# EAGLE design Nodino-RC7 (EAGLE 6.1)
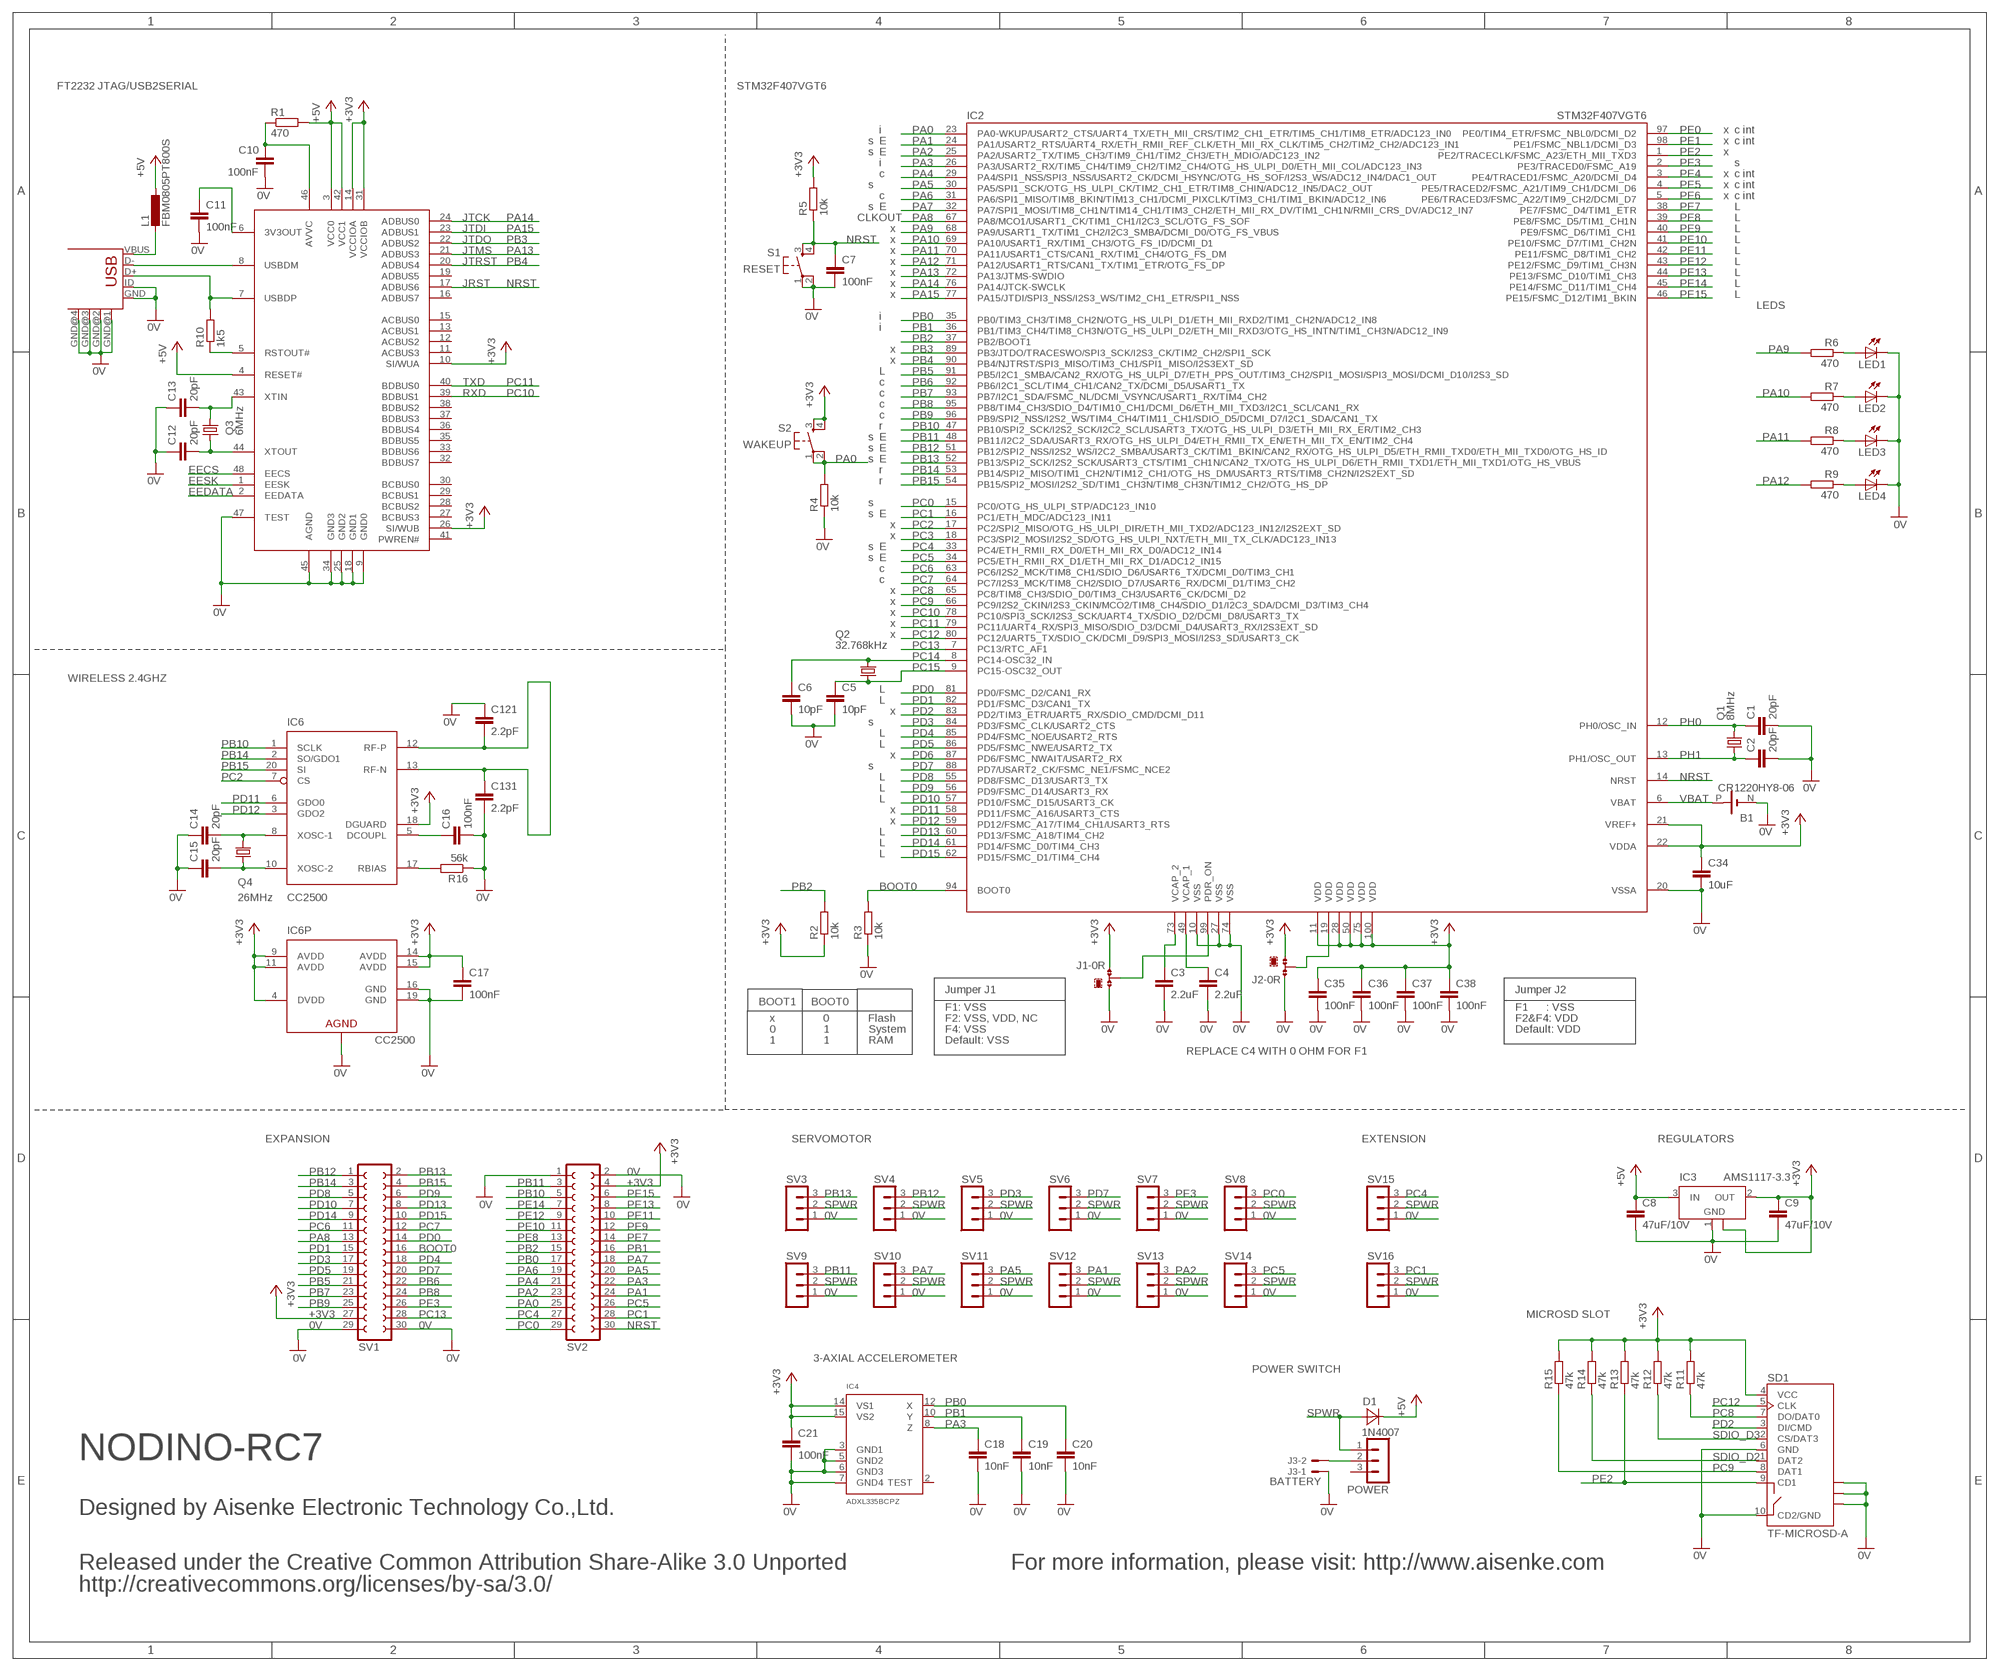
[diagram p0: schematic, sheet 1]

## Parts
B1  CR1220HY8-06  [HY8-06]
C1  20pF  C-EUC0603K  [C0603K]
C2  20pF  C-EUC0603K  [C0603K]
C3  2.2uF  C-EUC0603K  [C0603K]
C4  2.2uF  C-EUC0603K  [C0603K]
C5  10pF  C-EUC0603K  [C0603K]
C6  10pF  C-EUC0603K  [C0603K]
C7  100nF  C-EUC0603K  [C0603K]
C8  47uF/10V  C-EUC3225  [C3225]
C9  47uF/10V  C-EUC3225  [C3225]
C10  100nF  C-EUC0603K  [C0603K]
C11  100nF  C-EUC0603K  [C0603K]
C12  20pF  C-EUC0603K  [C0603K]
C13  20pF  C-EUC0603K  [C0603K]
C14  20pF  C-EUC0603K  [C0603K]
C15  20pF  C-EUC0603K  [C0603K]
C16  100nF  C-EUC0603K  [C0603K]
C17  100nF  C-EUC0603K  [C0603K]
C18  10nF  C-EUC0603K  [C0603K]
C19  10nF  C-EUC0603K  [C0603K]
C20  10nF  C-EUC0603K  [C0603K]
C21  100nF  C-EUC0603K  [C0603K]
C34  10uF  C-EUC0603K  [C0603K]
C35  100nF  C-EUC0603K  [C0603K]
C36  100nF  C-EUC0603K  [C0603K]
C37  100nF  C-EUC0603K  [C0603K]
C38  100nF  C-EUC0603K  [C0603K]
C121  2.2pF  C-EUC0603K  [C0603K]
C131  2.2pF  C-EUC0603K  [C0603K]
D1  1N4007  [DO214AC]
IC1  FT2232D  FT2232C  [LQFP48]
IC2  STM32F407VGT6  [LQFP100]
IC3  AMS1117-3.3  [SOT223]
IC4  ADXL335BCPZ  ADXL335WAVE  [LFCSP16-W]
IC6  CC2500  [QLP-20]
J1  0R-JUMPA0603  [A0R-JMP0603K]
J2  0R-JUMPA0603  [A0R-JMP0603K]
J3  BATTERY  22-27-2021-02  [6410-02]
L1  FBM0805PT800S  L-EUL0805  [L0805]
LED1  LEDCHIP-LED0805  [CHIP-LED0805]
LED2  LEDCHIP-LED0805  [CHIP-LED0805]
LED3  LEDCHIP-LED0805  [CHIP-LED0805]
LED4  LEDCHIP-LED0805  [CHIP-LED0805]
POWER  MA03-1  [MA03-1]
Q1  8MHz  CSM-7X-DU  [CSM-7X-DU]
Q2  32.768kHz  MC-306  [MC-306]
Q3  6MHz  CSM-7X-DU  [CSM-7X-DU]
Q4  26MHz  CSM-7X-DU  [CSM-7X-DU]
R1  470  R-EU_R0603K  [R0603K]
R2  10k  R-EU_R0603K  [R0603K]
R3  10k  R-EU_R0603K  [R0603K]
R4  10k  R-EU_R0603K  [R0603K]
R5  10k  R-EU_R0603K  [R0603K]
R6  470  R-EU_R0603K  [R0603K]
R7  470  R-EU_R0603K  [R0603K]
R8  470  R-EU_R0603K  [R0603K]
R9  470  R-EU_R0603K  [R0603K]
R10  1k5  R-EU_R0603K  [R0603K]
R11  47k  R-EU_R0603K  [R0603K]
R12  47k  R-EU_R0603K  [R0603K]
R13  47k  R-EU_R0603K  [R0603K]
R14  47k  R-EU_R0603K  [R0603K]
R15  47k  R-EU_R0603K  [R0603K]
R16  56k  R-EU_R0603K  [R0603K]
S1  RESET  ALCOSWITCH-SMD  [ALCOSWITCH-SMD]
S2  WAKEUP  ALCOSWITCH-SMD  [ALCOSWITCH-SMD]
SD1  TF-MICROSD-A  [MICROSD/CD]
SV1  FE15-2  [FE15-2]
SV2  FE15-2  [FE15-2]
SV3  MA03-1  [MA03-1]
SV4  MA03-1  [MA03-1]
SV5  MA03-1  [MA03-1]
SV6  MA03-1  [MA03-1]
SV7  MA03-1  [MA03-1]
SV8  MA03-1  [MA03-1]
SV9  MA03-1  [MA03-1]
SV10  MA03-1  [MA03-1]
SV11  MA03-1  [MA03-1]
SV12  MA03-1  [MA03-1]
SV13  MA03-1  [MA03-1]
SV14  MA03-1  [MA03-1]
SV15  MA03-1  [MA03-1]
SV16  MA03-1  [MA03-1]
USB1  USB-SHIELD  [USB-M-S1]

## Nets
0V: B1.N(-) C1.2 C2.2 C3.2 C4.2 C5.2 C6.2 C7.2 C8.2 C9.2 C10.2 C11.2 C12.1 C13.1 C14.1 C15.1 C16.2 C17.2 C18.2 C19.2 C20.2 C21.2 C34.2 C35.2 C36.2 C37.2 C38.2 C121.1 C131.2 IC1.9(GND0) IC1.18(GND1) IC1.25(GND2) IC1.34(GND3) IC1.45(AGND) IC1.47(TEST) IC2.10(VSS) IC2.20(VSSA) IC2.27(VSS) IC2.74(VSS) IC3.1(GND) IC4.3(GND1) IC4.5(GND2) IC4.6(GND3) IC4.7(GND4) IC6.16(GND) IC6.19(GND) IC6.21(AGND) J1.1 J2.3 J3.1 LED1.C LED2.C LED3.C LED4.C R3.1 R4.1 R16.1 S1.1(P) S1.2(P1) SD1.6(GND) SD1.10(CD2/GND) SD1.11(GND) SD1.12(GND) SD1.13(GND) SV1.29 SV1.30 SV2.1 SV2.2 SV3.1 SV4.1 SV5.1 SV6.1 SV7.1 SV8.1 SV9.1 SV10.1 SV11.1 SV12.1 SV13.1 SV14.1 SV15.1 SV16.1 USB1.GND USB1.GND@1(GND) USB1.GND@2(GND) USB1.GND@3(GND) USB1.GND@4(GND) USB1.ID
+3V3: C9.1 C17.1 C21.1 C34.1 C35.1 C36.1 C37.1 C38.1 IC1.10(SI/WUA) IC1.14(VCCIOA) IC1.26(SI/WUB) IC1.31(VCCIOB) IC2.11(VDD) IC2.21(VREF+) IC2.22(VDDA) IC2.28(VDD) IC2.50(VDD) IC2.75(VDD) IC2.100(VDD) IC3.2(OUT) IC3.4(GND) IC4.14(VS1) IC4.15(VS2) IC6.4(DVDD) IC6.9(AVDD) IC6.11(AVDD) IC6.14(AVDD) IC6.15(AVDD) IC6.18(DGUARD) J1.3 J2.1 R2.1 R5.2 R11.2 R12.2 R13.2 R14.2 R15.2 S2.3(S) S2.4(S1) SD1.4(VCC) SV1.27 SV2.4
+5V: C8.1 D1.C IC1.3(VCC0) IC1.4(RESET#) IC1.42(VCC1) IC3.3(IN) L1.1 R1.2
BOOT0: IC2.94(BOOT0) R3.2 SV1.16
DCOUPL: C16.1 IC6.5(DCOUPL)
EECS: IC1.48(EECS)
EEDATA: IC1.2(EEDATA)
EESK: IC1.1(EESK)
FOLDED_DIPOLE_ANTENNA: C121.2 C131.1 IC6.12(RF-P) IC6.13(RF-N)
N$1: C15.2 IC6.10(XOSC-2) Q4.1
N$2: C3.1 IC2.73(VCAP_2)
N$3: C14.2 IC6.8(XOSC-1) Q4.2
N$4: C4.1 IC2.49(VCAP_1)
N$5: IC1.8(USBDM) USB1.D-
N$6: IC2.99(PDR_ON) J1.2
N$7: LED1.A R6.1
N$8: LED2.A R7.1
N$9: LED3.A R8.1
N$10: LED4.A R9.1
N$11: IC1.7(USBDP) R10.2 USB1.D+
N$12: L1.2 USB1.VBUS
N$13: IC1.5(RSTOUT#) R10.1
N$14: C10.1 IC1.46(AVVC) R1.1
N$15: C11.1 IC1.6(3V3OUT)
N$16: C12.2 IC1.44(XTOUT) Q3.1
N$17: C13.2 IC1.43(XTIN) Q3.2
N$18: IC6.17(RBIAS) R16.2
N$19: IC2.19(VDD) J2.2
N$20: J3.2 POWER.2
NRST: C7.1 IC1.17(ADBUS6) IC2.14(NRST) R5.1 S1.3(S) S1.4(S1) SV2.30
PA0: IC2.23(PA0-WKUP/USART2_CTS/UART4_TX/ETH_MII_CRS/TIM2_CH1_ETR/TIM5_CH1/TIM8_ETR/ADC123_IN0) R4.2 S2.1(P) S2.2(P1) SV2.25
PA1: IC2.24(PA1/USART2_RTS/UART4_RX/ETH_RMII_REF_CLK/ETH_MII_RX_CLK/TIM5_CH2/TIM2_CH2/ADC123_IN1) SV2.24 SV12.3
PA2: IC2.25(PA2/USART2_TX/TIM5_CH3/TIM9_CH1/TIM2_CH3/ETH_MDIO/ADC123_IN2) SV2.23 SV13.3
PA3: C18.1 IC2.26(PA3/USART2_RX/TIM5_CH4/TIM9_CH2/TIM2_CH4/OTG_HS_ULPI_D0/ETH_MII_COL/ADC123_IN3) IC4.8(Z) SV2.22
PA4: IC2.29(PA4/SPI1_NSS/SPI3_NSS/USART2_CK/DCMI_HSYNC/OTG_HS_SOF/I2S3_WS/ADC12_IN4/DAC1_OUT) SV2.21
PA5: IC2.30(PA5/SPI1_SCK/OTG_HS_ULPI_CK/TIM2_CH1_ETR/TIM8_CHIN/ADC12_IN5/DAC2_OUT) SV2.20 SV11.3
PA6: IC2.31(PA6/SPI1_MISO/TIM8_BKIN/TIM13_CH1/DCMI_PIXCLK/TIM3_CH1/TIM1_BKIN/ADC12_IN6) SV2.19
PA7: IC2.32(PA7/SPI1_MOSI/TIM8_CH1N/TIM14_CH1/TIM3_CH2/ETH_MII_RX_DV/TIM1_CH1N/RMII_CRS_DV/ADC12_IN7) SV2.18 SV10.3
PA8: IC2.67(PA8/MCO1/USART1_CK/TIM1_CH1/I2C3_SCL/OTG_FS_SOF) SV1.13
PA9: IC2.68(PA9/USART1_TX/TIM1_CH2/I2C3_SMBA/DCMI_D0/OTG_FS_VBUS) R6.2
PA10: IC2.69(PA10/USART1_RX/TIM1_CH3/OTG_FS_ID/DCMI_D1) R7.2
PA11: IC2.70(PA11/USART1_CTS/CAN1_RX/TIM1_CH4/OTG_FS_DM) R8.2
PA12: IC2.71(PA12/USART1_RTS/CAN1_TX/TIM1_ETR/OTG_FS_DP) R9.2
PA13: IC1.21(ADBUS3) IC2.72(PA13/JTMS-SWDIO)
PA14: IC1.24(ADBUS0) IC2.76(PA14/JTCK-SWCLK)
PA15: IC1.23(ADBUS1) IC2.77(PA15/JTDI/SPI3_NSS/I2S3_WS/TIM2_CH1_ETR/SPI1_NSS)
PB0: C20.1 IC2.35(PB0/TIM3_CH3/TIM8_CH2N/OTG_HS_ULPI_D1/ETH_MII_RXD2/TIM1_CH2N/ADC12_IN8) IC4.12(X) SV2.17
PB1: C19.1 IC2.36(PB1/TIM3_CH4/TIM8_CH3N/OTG_HS_ULPI_D2/ETH_MII_RXD3/OTG_HS_INTN/TIM1_CH3N/ADC12_IN9) IC4.10(Y) SV2.16
PB2: IC2.37(PB2/BOOT1) R2.2 SV2.15
PB3: IC1.22(ADBUS2) IC2.89(PB3/JTDO/TRACESWO/SPI3_SCK/I2S3_CK/TIM2_CH2/SPI1_SCK)
PB4: IC1.20(ADBUS4) IC2.90(PB4/NJTRST/SPI3_MISO/TIM3_CH1/SPI1_MISO/I2S3EXT_SD)
PB5: IC2.91(PB5/I2C1_SMBA/CAN2_RX/OTG_HS_ULPI_D7/ETH_PPS_OUT/TIM3_CH2/SPI1_MOSI/SPI3_MOSI/DCMI_D10/I2S3_SD) SV1.21
PB6: IC2.92(PB6/I2C1_SCL/TIM4_CH1/CAN2_TX/DCMI_D5/USART1_TX) SV1.22
PB7: IC2.93(PB7/I2C1_SDA/FSMC_NL/DCMI_VSYNC/USART1_RX/TIM4_CH2) SV1.23
PB8: IC2.95(PB8/TIM4_CH3/SDIO_D4/TIM10_CH1/DCMI_D6/ETH_MII_TXD3/I2C1_SCL/CAN1_RX) SV1.24
PB9: IC2.96(PB9/SPI2_NSS/I2S2_WS/TIM4_CH4/TIM11_CH1/SDIO_D5/DCMI_D7/I2C1_SDA/CAN1_TX) SV1.25
PB10: IC2.47(PB10/SPI2_SCK/I2S2_SCK/I2C2_SCL/USART3_TX/OTG_HS_ULPI_D3/ETH_MII_RX_ER/TIM2_CH3) IC6.1(SCLK) SV2.5
PB11: IC2.48(PB11/I2C2_SDA/USART3_RX/OTG_HS_ULPI_D4/ETH_RMII_TX_EN/ETH_MII_TX_EN/TIM2_CH4) SV2.3 SV9.3
PB12: IC2.51(PB12/SPI2_NSS/I2S2_WS/I2C2_SMBA/USART3_CK/TIM1_BKIN/CAN2_RX/OTG_HS_ULPI_D5/ETH_RMII_TXD0/ETH_MII_TXD0/OTG_HS_ID) SV1.1 SV4.3
PB13: IC2.52(PB13/SPI2_SCK/I2S2_SCK/USART3_CTS/TIM1_CH1N/CAN2_TX/OTG_HS_ULPI_D6/ETH_RMII_TXD1/ETH_MII_TXD1/OTG_HS_VBUS) SV1.2 SV3.3
PB14: IC2.53(PB14/SPI2_MISO/TIM1_CH2N/TIM12_CH1/OTG_HS_DM/USART3_RTS/TIM8_CH2N/I2S2EXT_SD) IC6.2(SO/GDO1) SV1.3
PB15: IC2.54(PB15/SPI2_MOSI/I2S2_SD/TIM1_CH3N/TIM8_CH3N/TIM12_CH2/OTG_HS_DP) IC6.20(SI) SV1.4
PC0: IC2.15(PC0/OTG_HS_ULPI_STP/ADC123_IN10) SV2.29 SV8.3
PC1: IC2.16(PC1/ETH_MDC/ADC123_IN11) SV2.28 SV16.3
PC2: IC2.17(PC2/SPI2_MISO/OTG_HS_ULPI_DIR/ETH_MII_TXD2/ADC123_IN12/I2S2EXT_SD) IC6.7(CS)
PC3: IC2.18(PC3/SPI2_MOSI/I2S2_SD/OTG_HS_ULPI_NXT/ETH_MII_TX_CLK/ADC123_IN13)
PC4: IC2.33(PC4/ETH_RMII_RX_D0/ETH_MII_RX_D0/ADC12_IN14) SV2.27 SV15.3
PC5: IC2.34(PC5/ETH_RMII_RX_D1/ETH_MII_RX_D1/ADC12_IN15) SV2.26 SV14.3
PC6: IC2.63(PC6/I2S2_MCK/TIM8_CH1/SDIO_D6/USART6_TX/DCMI_D0/TIM3_CH1) SV1.11
PC7: IC2.64(PC7/I2S3_MCK/TIM8_CH2/SDIO_D7/USART6_RX/DCMI_D1/TIM3_CH2) SV1.12
PC8: IC2.65(PC8/TIM8_CH3/SDIO_D0/TIM3_CH3/USART6_CK/DCMI_D2) R11.1 SD1.7(DO/DAT0)
PC9: IC2.66(PC9/I2S2_CKIN/I2S3_CKIN/MCO2/TIM8_CH4/SDIO_D1/I2C3_SDA/DCMI_D3/TIM3_CH4) R15.1 SD1.8(DAT1)
PC10: IC1.39(BDBUS1) IC2.78(PC10/SPI3_SCK/I2S3_SCK/UART4_TX/SDIO_D2/DCMI_D8/USART3_TX)
PC11: IC1.40(BDBUS0) IC2.79(PC11/UART4_RX/SPI3_MISO/SDIO_D3/DCMI_D4/USART3_RX/I2S3EXT_SD)
PC12: IC2.80(PC12/UART5_TX/SDIO_CK/DCMI_D9/SPI3_MOSI/I2S3_SD/USART3_CK) SD1.5(CLK)
PC13: IC2.7(PC13/RTC_AF1) SV1.28
PC14: C6.1 IC2.8(PC14-OSC32_IN) Q2.4
PC15: C5.1 IC2.9(PC15-OSC32_OUT) Q2.1
PD0: IC2.81(PD0/FSMC_D2/CAN1_RX) SV1.14
PD1: IC2.82(PD1/FSMC_D3/CAN1_TX) SV1.15
PD2: IC2.83(PD2/TIM3_ETR/UART5_RX/SDIO_CMD/DCMI_D11) SD1.3(DI/CMD)
PD3: IC2.84(PD3/FSMC_CLK/USART2_CTS) SV1.17 SV5.3
PD4: IC2.85(PD4/FSMC_NOE/USART2_RTS) SV1.18
PD5: IC2.86(PD5/FSMC_NWE/USART2_TX) SV1.19
PD6: IC2.87(PD6/FSMC_NWAIT/USART2_RX)
PD7: IC2.88(PD7/USART2_CK/FSMC_NE1/FSMC_NCE2) SV1.20 SV6.3
PD8: IC2.55(PD8/FSMC_D13/USART3_TX) SV1.5
PD9: IC2.56(PD9/FSMC_D14/USART3_RX) SV1.6
PD10: IC2.57(PD10/FSMC_D15/USART3_CK) SV1.7
PD11: IC2.58(PD11/FSMC_A16/USART3_CTS) IC6.6(GDO0)
PD12: IC2.59(PD12/FSMC_A17/TIM4_CH1/USART3_RTS) IC6.3(GDO2)
PD13: IC2.60(PD13/FSMC_A18/TIM4_CH2) SV1.8
PD14: IC2.61(PD14/FSMC_D0/TIM4_CH3) SV1.9
PD15: IC2.62(PD15/FSMC_D1/TIM4_CH4) SV1.10
PE0: IC2.97(PE0/TIM4_ETR/FSMC_NBL0/DCMI_D2)
PE1: IC2.98(PE1/FSMC_NBL1/DCMI_D3)
PE2: IC2.1(PE2/TRACECLK/FSMC_A23/ETH_MII_TXD3) R13.1 SD1.9(CD1)
PE3: IC2.2(PE3/TRACED0/FSMC_A19) SV1.26 SV7.3
PE4: IC2.3(PE4/TRACED1/FSMC_A20/DCMI_D4)
PE5: IC2.4(PE5/TRACED2/FSMC_A21/TIM9_CH1/DCMI_D6)
PE6: IC2.5(PE6/TRACED3/FSMC_A22/TIM9_CH2/DCMI_D7)
PE7: IC2.38(PE7/FSMC_D4/TIM1_ETR) SV2.14
PE8: IC2.39(PE8/FSMC_D5/TIM1_CH1N) SV2.13
PE9: IC2.40(PE9/FSMC_D6/TIM1_CH1) SV2.12
PE10: IC2.41(PE10/FSMC_D7/TIM1_CH2N) SV2.11
PE11: IC2.42(PE11/FSMC_D8/TIM1_CH2) SV2.10
PE12: IC2.43(PE12/FSMC_D9/TIM1_CH3N) SV2.9
PE13: IC2.44(PE13/FSMC_D10/TIM1_CH3) SV2.8
PE14: IC2.45(PE14/FSMC_D11/TIM1_CH4) SV2.7
PE15: IC2.46(PE15/FSMC_D12/TIM1_BKIN) SV2.6
PH0: C1.1 IC2.12(PH0/OSC_IN) Q1.2
PH1: C2.1 IC2.13(PH1/OSC_OUT) Q1.1
SDIO_D2: R14.1 SD1.1(DAT2)
SDIO_D3: R12.1 SD1.2(CS/DAT3)
SPWR: D1.A POWER.1 SV3.2 SV4.2 SV5.2 SV6.2 SV7.2 SV8.2 SV9.2 SV10.2 SV11.2 SV12.2 SV13.2 SV14.2 SV15.2 SV16.2
VBAT: B1.P(+) IC2.6(VBAT)
Unconnected: IC1.11(ACBUS3) IC1.12(ACBUS2) IC1.13(ACBUS1) IC1.15(ACBUS0) IC1.16(ADBUS7) IC1.19(ADBUS5) IC1.27(BCBUS3) IC1.28(BCBUS2) IC1.29(BCBUS1) IC1.30(BCBUS0) IC1.32(BDBUS7) IC1.33(BDBUS6) IC1.35(BDBUS5) IC1.36(BDBUS4) IC1.37(BDBUS3) IC1.38(BDBUS2) IC1.41(PWREN#) IC4.2(TEST) POWER.3

## Notes on the sheet
- FT2232 JTAG/USB2SERIAL | STM32F407VGT6
- i | x | c int
- s | E | x | c int
- s | E | x
- i | s
- c | x | c int
- s | x | c int
- c | x | c int
- s | E | L
- JTCK | CLKOUT | L
- JTDI | x | L
- JTDO | x | L
- JTMS | x | L
- JTRST | x | L
- x | L
- JRST | x | L
- x | L
- LEDS
- i
- i
- x
- x
- L
- TXD | c
- RXD | c
- c
- c
- r
- s | E
- s | E
- s | E
- r
- r
- s
- s | E
- x
- x
- s | E
- s | E
- c
- c
- x
- x
- x
- x
- x
- WIRELESS 2.4GHZ
- L
- L
- x
- s
- L
- L
- x
- s
- L
- L
- L
- x
- x
- L
- L
- L
- Jumper J1 | Jumper J2
- BOOT1     BOOT0
- F1: VSS | F1      : VSS
- x                0             Flash | F2: VSS, VDD, NC | F2&F4: VDD
- 0                1             System | F4: VSS | Default: VDD
- 1                1             RAM | Default: VSS
- REPLACE C4 WITH 0 OHM FOR F1
- EXPANSION | SERVOMOTOR | EXTENSION | REGULATORS
- MICROSD SLOT
- 3-AXIAL ACCELEROMETER
- POWER SWITCH
- NODINO-RC7
- Designed by Aisenke Electronic Technology Co.,Ltd.
- Released under the Creative Common Attribution Share-Alike 3.0 Unported | For more information, please visit: http://www.aisenke.com
- http://creativecommons.org/licenses/by-sa/3.0/

## Library data of the parts
B1 = con-batteryholder:CR1220
C1-C21 C34-C38 C121 C131 = resistor:C-EU: CAPACITOR, European symbol
D1 = diode:1N4007
IC1 = ftdichip-3:FT2232C: USB UART / FIFO Controller 3nd Generation USB Double-UART (USB <-> Serial) - FIFO Controller
IC2 = stm32fxxx:STM32F407V: STM32F4xx High Performance Line with DSP in 100 pin packages
IC3 = advanced-micro-system:AMS1117: 1A Low Drop Output Voltage Regulator
IC4 = microbuilder:ADXL335: ADXL335 Low-Power 3 Axis Accelerometer LFCSP16-R - 16 Pin LFCSP Package (Reflow footprint) LFSCP16-W - 16 Pin LFCSP Package (Wave footprint with extended pads for hand soldering) Digikey: ADXL335BCPZ-RL7CT-ND
IC6 = chipcon-ti:CC2500: Single Chip Low Cost Low Power RF Transceiver frequency band at 2400MHz-2483.5MHz.
J1 J2 = jump-0r-smd:0R-JUMP: SMD 0R 0805 Jumper
J3 = con-molex:22-?-02: CONNECTOR wire to board 2.54 mm (.1 inch) pitch header; OC_FARNELL: unknown; OC_NEWARK: unknown
L1 = resistor:L-EU: INDUCTOR, European symbol
LED1-LED4 = led:LED: LED OSRAM: - CHIPLED LG R971, LG N971, LY N971, LG Q971, LY Q971, LO R971, LY R971 LH N974, LH R974 LS Q976, LO Q976, LY Q976 LO Q996 - Hyper CHIPLED LW Q18S LB Q993, LB Q99A, LB R99A - SideLED LS A670, LO A670, LY A670, LG A670, LP A670 LB A673, LV A673, LT A673, LW A673 LH A674 LY A675 LS A676, LA A676, LO A676, LY A676, LW A676 LS A679, LY A679, LG A679 - Hyper Micro SIDELED® LS Y876, LA Y876, LO Y876, LY Y876 LT Y87S - SmartLED LW L88C, LW L88S LB L89C, LB L89S, LG L890 LS L89K, LO L89K, LY L89K LS L896, LA L896, LO L896, LY L896 - TOPLED LS T670, LO T670, LY T670, LG T670, LP T670 LSG T670, LSP T670, LSY T670, LOP T670, LYG T670 LG T671, LOG T671, LSG T671 LB T673, LV T673, LT T673, LW T673 LH T674 LS T676, LA T676, LO T676, LY T676, LB T676, LH T676, LSB T676, LW T676 LB T67C, LV T67C, LT T67C, LS T67K, LO T67K, LY T67K, LW E67C LS E67B, LA E67B, LO E67B, LY E67B, LB E67C, LV E67C, LT E67C LW T67C LS T679, LY T679, LG T679 LS T770, LO T770, LY T770, LG T770, LP T770 LB T773, LV T773, LT T773, LW T773 LH T774 LS E675, LA E675, LY E675, LS T675 LS T776, LA T776, LO T776, LY T776, LB T776 LHGB T686 LT T68C, LB T68C - Hyper Mini TOPLED® LB M676 - Mini TOPLED Santana® LG M470 LS M47K, LO M47K, LY M47K Source: http://www.osram.convergy.de LUXEON: - LUMILED® LXK2-PW12-R00, LXK2-PW12-S00, LXK2-PW14-U00, LXK2-PW14-V00 LXK2-PM12-R00, LXK2-PM12-S00, LXK2-PM14-U00 LXK2-PE12-Q00, LXK2-PE12-R00, LXK2-PE12-S00, LXK2-PE14-T00, LXK2-PE14-U00 LXK2-PB12-K00, LXK2-PB12-L00, LXK2-PB12-M00, LXK2-PB14-N00, LXK2-PB14-P00, LXK2-PB14-Q00 LXK2-PR12-L00, LXK2-PR12-M00, LXK2-PR14-Q00, LXK2-PR14-R00 LXK2-PD12-Q00, LXK2-PD12-R00, LXK2-PD12-S00 LXK2-PH12-R00, LXK2-PH12-S00 LXK2-PL12-P00, LXK2-PL12-Q00, LXK2-PL12-R00 Source: www.luxeon.com KINGBRIGHT: KA-3528ASYC Source: www.kingbright.com
POWER SV3-SV16 = con-lstb:MA03-1: PIN HEADER; OC_FARNELL: unknown; OC_NEWARK: unknown
Q1 Q3 Q4 = crystal:CSM-7X-DU: SMD CRYSTAL Source: www.ecsxtal.com .. Crystal 3.6864MHz CSM_7X_DU.PDF; OC_FARNELL: unknown; OC_NEWARK: unknown
Q2 = crystal:MC-306: kHz RANGE CRYSTAL UNIT SMD Source: MC-306_405_406_E07X.PDF Homepage <http://www.epsontoyocom.co.jp>; MPN: MC-306 60.0KHZ 100PPM ,12.5PF; OC_FARNELL: 1278040; OC_NEWARK: 31M5576
R1-R16 = resistor:R-EU_: RESISTOR, European symbol
S1 S2 = switch-alco:ALCOSWITCH-SMD
SD1 = con-tf-microsd:TF-MICROSD-A
SV1 SV2 = con-lsta:FE15-2: FEMALE HEADER; OC_FARNELL: unknown; OC_NEWARK: unknown
USB1 = con-usb-2:USB-SHIELD

## Board
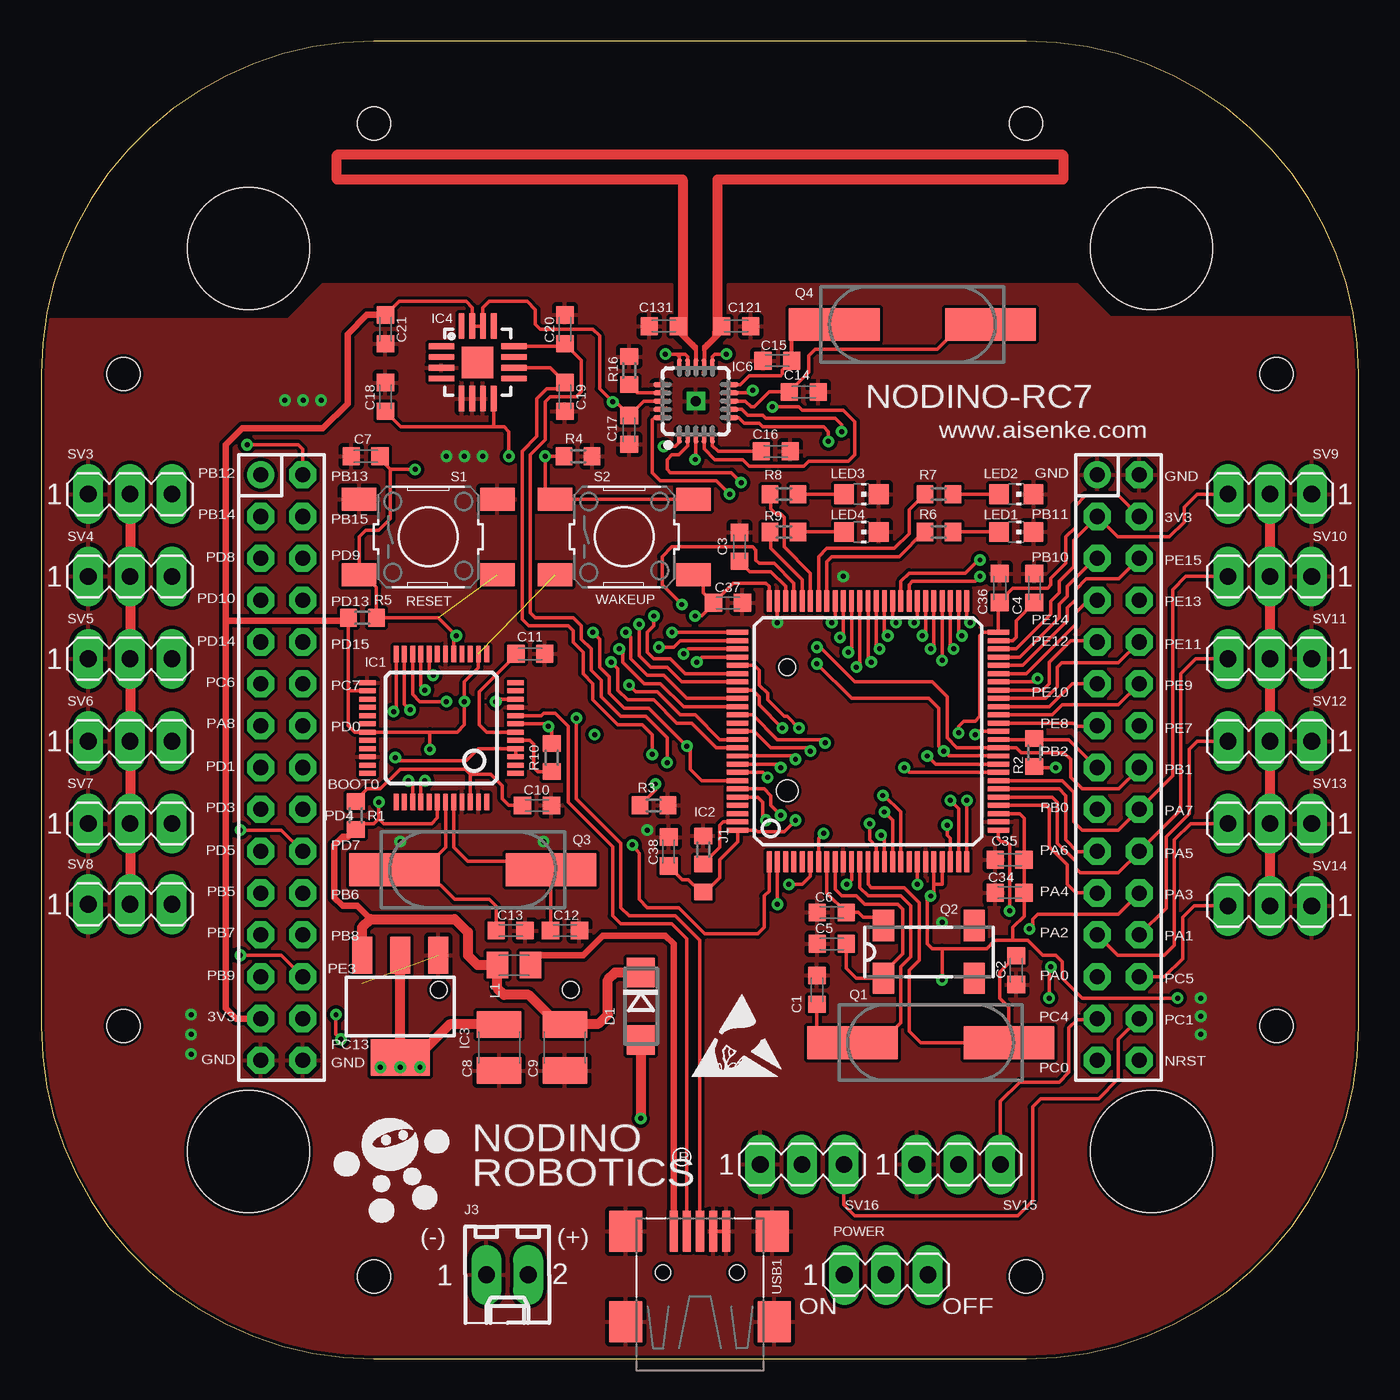
[diagram p1: board, top side]
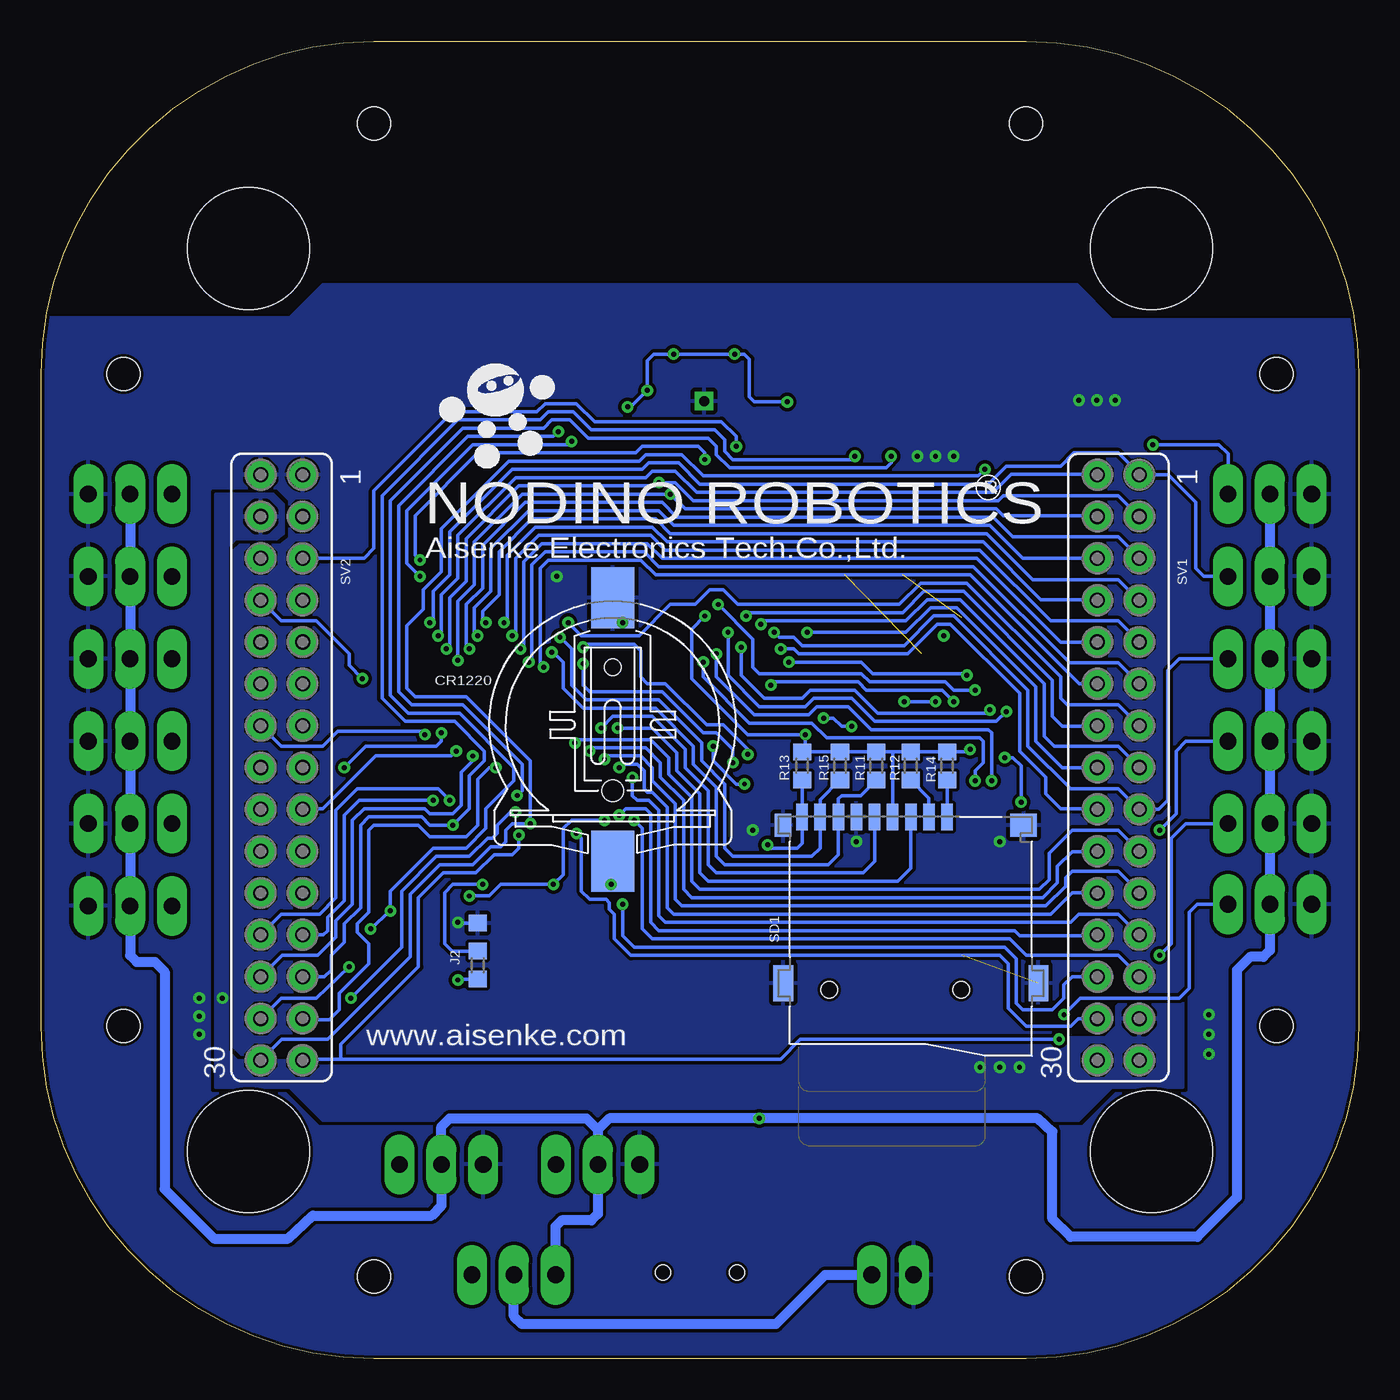
[diagram p2: board, bottom side, seen from below]

Size 80 x 80 mm. Coordinates in mm from the lower left corner, seen from the top.
Outline: 0,59.8 0,20.2 arc90 20.2,0 59.8,0 arc90 80,20.2 80,59.8 arc90 59.8,80 20.2,80 arc90 0,59.8
Copper layers (1*16): Top 0.035mm / dielectric 1.5mm / Bottom 0.035mm
Design rules: minimum track width 0.2mm, minimum drill 0.3mm, track to track 8mil, track to pad 8mil, pad to pad 7mil, via to via 8mil, smd to smd 7mil, copper to edge 8mil, drill to drill 8mil, minimum pad ring 10mil, minimum via ring 8mil, stop-mask expansion 2mil, vias tented up to drill 0mil, thermal gap 10mil
Holes 7.4 mm at 12.6,12.6 12.6,67.4 67.4,67.4 67.4,12.6
Holes 2 mm at 5,20.2 20.2,5 5,59.8 20.2,75 75,59.8 59.8,75 59.8,5 75,20.2

### Footprints (pad centres in the part's own frame; a part is rotated, then mirrored left to right if it is on the bottom)
HY8-06 = smd 3.7 x 2.6: N -7.7,0; P 8.3,0 | hole 1: -3.5,0 | hole 1.3: 4,0
C0603K = smd 1.05 x 1.08: 1 -0.875,0; 2 0.875,0
C3225 = smd 1.6 x 2.7: 1 -1.4,0; 2 1.4,0
DO214AC = smd 1.8 x 1.7: A 2.05,0; C -2.05,0
LQFP48 = smd 0.3 x 1: 1 -2.75,-4.5; 2 -2.25,-4.5; 3 -1.75,-4.5; 4 -1.25,-4.5; 5 -0.75,-4.5; 6 -0.25,-4.5; 7 0.25,-4.5; 8 0.75,-4.5; 9 1.25,-4.5; 10 1.75,-4.5; 11 2.25,-4.5; 12 2.75,-4.5; 25 2.75,4.5; 26 2.25,4.5; 27 1.75,4.5; 28 1.25,4.5; 29 0.75,4.5; 30 0.25,4.5; 31 -0.25,4.5; 32 -0.75,4.5; 33 -1.25,4.5; 34 -1.75,4.5; 35 -2.25,4.5; 36 -2.75,4.5 | smd 1 x 0.3: 13 4.5,-2.75; 14 4.5,-2.25; 15 4.5,-1.75; 16 4.5,-1.25; 17 4.5,-0.75; 18 4.5,-0.25; 19 4.5,0.25; 20 4.5,0.75; 21 4.5,1.25; 22 4.5,1.75; 23 4.5,2.25; 24 4.5,2.75; 37 -4.5,2.75; 38 -4.5,2.25; 39 -4.5,1.75; 40 -4.5,1.25; 41 -4.5,0.75; 42 -4.5,0.25; 43 -4.5,-0.25; 44 -4.5,-0.75; 45 -4.5,-1.25; 46 -4.5,-1.75; 47 -4.5,-2.25; 48 -4.5,-2.75
LQFP100 = smd 1.3 x 0.3: 1 -7.92,6; 2 -7.92,5.5; 3 -7.92,5; 4 -7.92,4.5; 5 -7.92,4; 6 -7.92,3.5; 7 -7.92,3; 8 -7.92,2.5; 9 -7.92,2; 10 -7.92,1.5; 11 -7.92,1; 12 -7.92,0.5; 13 -7.92,0; 14 -7.92,-0.5; 15 -7.92,-1; 16 -7.92,-1.5; 17 -7.92,-2; 18 -7.92,-2.5; 19 -7.92,-3; 20 -7.92,-3.5; 21 -7.92,-4; 22 -7.92,-4.5; 23 -7.92,-5; 24 -7.92,-5.5; 25 -7.92,-6; 51 7.92,-6; 52 7.92,-5.5; 53 7.92,-5; 54 7.92,-4.5; 55 7.92,-4; 56 7.92,-3.5; 57 7.92,-3; 58 7.92,-2.5; 59 7.92,-2; 60 7.92,-1.5; 61 7.92,-1; 62 7.92,-0.5; 63 7.92,0; 64 7.92,0.5; 65 7.92,1; 66 7.92,1.5; 67 7.92,2; 68 7.92,2.5; 69 7.92,3; 70 7.92,3.5; 71 7.92,4; 72 7.92,4.5; 73 7.92,5; 74 7.92,5.5; 75 7.92,6 | smd 0.3 x 1.3: 26 -6,-7.92; 27 -5.5,-7.92; 28 -5,-7.92; 29 -4.5,-7.92; 30 -4,-7.92; 31 -3.5,-7.92; 32 -3,-7.92; 33 -2.5,-7.92; 34 -2,-7.92; 35 -1.5,-7.92; 36 -1,-7.92; 37 -0.5,-7.92; 38 0,-7.92; 39 0.5,-7.92; 40 1,-7.92; 41 1.5,-7.92; 42 2,-7.92; 43 2.5,-7.92; 44 3,-7.92; 45 3.5,-7.92; 46 4,-7.92; 47 4.5,-7.92; 48 5,-7.92; 49 5.5,-7.92; 50 6,-7.92; 76 6,7.92; 77 5.5,7.92; 78 5,7.92; 79 4.5,7.92; 80 4,7.92; 81 3.5,7.92; 82 3,7.92; 83 2.5,7.92; 84 2,7.92; 85 1.5,7.92; 86 1,7.92; 87 0.5,7.92; 88 0,7.92; 89 -0.5,7.92; 90 -1,7.92; 91 -1.5,7.92; 92 -2,7.92; 93 -2.5,7.92; 94 -3,7.92; 95 -3.5,7.92; 96 -4,7.92; 97 -4.5,7.92; 98 -5,7.92; 99 -5.5,7.92; 100 -6,7.92
SOT223 = smd 1.219 x 2.235: 1 -2.311,-3.099; 2 0,-3.099; 3 2.311,-3.099 | smd 3.6 x 2.2: 4 0,3.099
LFCSP16-W = smd 1.9 x 1.9: 0 0,0 | smd 1.558 x 0.35: 1 -2.204,0.975; 2 -2.204,0.325; 3 -2.204,-0.325; 4 -2.204,-0.975; 9 2.204,-0.975; 10 2.204,-0.325; 11 2.204,0.325; 12 2.204,0.975 | smd 0.35 x 1.558: 5 -0.975,-2.204; 6 -0.325,-2.204; 7 0.325,-2.204; 8 0.975,-2.204; 13 0.975,2.204; 14 0.325,2.204; 15 -0.325,2.204; 16 -0.975,2.204
QLP-20 = smd 0.95 x 0.3: 1 -2.1,1; 2 -2.1,0.5; 3 -2.1,0; 4 -2.1,-0.5; 5 -2.1,-1; 11 2.1,-1; 12 2.1,-0.5; 13 2.1,0; 14 2.1,0.5; 15 2.1,1 | smd 0.3 x 0.95: 6 -1,-2.1; 7 -0.5,-2.1; 8 0,-2.1; 9 0.5,-2.1; 10 1,-2.1; 16 1,2.1; 17 0.5,2.1; 18 0,2.1; 19 -0.5,2.1; 20 -1,2.1 | drill 0.6 pad 1 square: 21 0,0
A0R-JMP0603K = smd 1.1 x 1: 1 0,0.85; 2 0,-0.85; 3 0,-2.552
6410-02 = drill 1.016 long: 1 1.27,0; 2 -1.27,0
L0805 = smd 1.3 x 1.6: 1 -1,0; 2 1,0
CHIP-LED0805 = smd 1.2 x 1.2: A 0,-1.05; C 0,1.05
MA03-1 = drill 1.016 long: 1 -2.54,0; 2 0,0; 3 2.54,0
CSM-7X-DU = smd 5.5 x 2: 1 -4.75,0; 2 4.75,0
MC-306 = smd 1.3 x 1.9: 1 -2.75,-1.6; 2 2.75,-1.6; 3 2.75,1.6; 4 -2.75,1.6
R0603K = smd 1 x 1.1: 1 -0.85,0; 2 0.85,0
ALCOSWITCH-SMD = smd 2.1 x 1.4: 1 -4.2,2.3; 2 4.2,2.3; 3 -4.2,-2.3; 4 4.2,-2.3
MICROSD/CD = smd 0.7 x 1.6: 1 2.2,3.5; 2 1.1,3.5; 3 0,3.5; 4 -1.1,3.5; 5 -2.2,3.5; 6 -3.3,3.5; 7 -4.4,3.5; 8 -5.5,3.5; 9 -6.6,3.5 | smd 1 x 1.4: 10 -7.75,3 | smd 1.2 x 2.2: 11 -7.75,-6.6; 12 7.75,-6.6 | smd 1.6 x 1.4: 13 6.85,3 | hole 1: 3.05,-7; -4.95,-7
FE15-2 = drill 0.914: 1 -17.78,1.27 | drill 0.914 octagon: 2 -17.78,-1.27; 3 -15.24,1.27; 4 -15.24,-1.27; 5 -12.7,1.27; 6 -12.7,-1.27; 7 -10.16,1.27; 8 -10.16,-1.27; 9 -7.62,1.27; 10 -7.62,-1.27; 11 -5.08,1.27; 12 -5.08,-1.27; 13 -2.54,1.27; 14 -2.54,-1.27; 15 0,1.27; 16 0,-1.27; 17 2.54,1.27; 18 2.54,-1.27; 19 5.08,1.27; 20 5.08,-1.27; 21 7.62,1.27; 22 7.62,-1.27; 23 10.16,1.27; 24 10.16,-1.27; 25 12.7,1.27; 26 12.7,-1.27; 27 15.24,1.27; 28 15.24,-1.27; 29 17.78,1.27; 30 17.78,-1.27
USB-M-S1 = smd 2.5 x 0.5: D+ 2.75,0; D- 2.75,0.8; GND 2.75,-1.6; ID 2.75,-0.8; VBUS 2.75,1.6 | smd 2.5 x 2: GND@1 -2.75,-4.5; GND@2 -2.75,4.5; GND@3 2.75,-4.4; GND@4 2.75,4.5 | hole 0.9: 0.25,2.25; 0.25,-2.25

### Placement (x,y rotation side)
B1  45.3,38.5 270 bottom
C1  47.1,22.4 90 top
C2  59.2,23.6 270 top
C3  42.4,49.3 90 top
C4  60.3,46.8 90 top
C5  48,25.2 180 top
C6  48,27.1 180 top
C7  19.7,54.8 180 top
C8  31.8,18.9 270 top
C9  27.8,18.9 270 top
C10  30.1,33.6 0 top
C11  29.7,42.8 0 top
C12  31.8,26 180 top
C13  28.5,26 180 top
C14  46.3,58.7 180 top
C15  44.7,60.6 0 top
C16  44.6,55.1 0 top
C17  35.7,56.4 270 top
C18  20.9,58.4 90 top
C19  31.8,58.4 270 top
C20  31.8,62.5 90 top
C21  20.9,62.5 270 top
C34  58.8,28.3 180 top
C35  58.8,30.3 180 top
C36  58.2,46.8 90 top
C37  41.7,45.9 0 top
C38  38.1,30.8 90 top
C121  42.2,62.7 180 top
C131  37.8,62.7 180 top
D1  36.4,21.4 270 top
IC1  24.3,38.3 90 top
IC2  50.2,38.1 90 top
IC3  21.8,21.4 180 top
IC4  26.5,60.5 0 top
IC6  39.75,58.15 90 top
J1  40.2,30.9 0 top
J2  53.5,23.9 180 bottom
J3  28.3,5.1 180 top
L1  28.7,23.9 0 top
LED1  59.2,50.2 270 top
LED2  59.2,52.5 270 top
LED3  49.8,52.5 270 top
LED4  49.8,50.2 270 top
POWER  51.3,5.1 0 top
Q1  54,19.2 180 top
Q2  53.9,24.7 0 top
Q3  26.2,29.7 180 top
Q4  52.9,62.8 0 top
R1  19.1,33 270 top
R2  60.3,36.8 90 top
R3  37.2,33.6 180 top
R4  32.6,54.8 180 top
R5  19.5,45 180 top
R6  54.5,50.2 180 top
R7  54.5,52.5 180 top
R8  45.1,52.5 180 top
R9  45.1,50.2 180 top
R10  31,36.5 90 top
R11  29.3,36 90 bottom
R12  27.2,36 90 bottom
R13  33.8,36 90 bottom
R14  25,36 90 bottom
R15  31.5,36 90 bottom
R16  35.7,60 270 top
S1  23.5,49.9 0 top
S2  35.4,49.9 0 top
SD1  27.2,29.4 0 bottom
SV1  14.6,35.9 270 bottom
SV2  65.4,35.9 270 bottom
SV3  5.4,52.5 0 top
SV4  5.4,47.5 0 top
SV5  5.4,42.5 0 top
SV6  5.4,37.5 0 top
SV7  5.4,32.5 0 top
SV8  5.4,27.6 0 top
SV9  74.6,52.5 180 top
SV10  74.6,47.5 180 top
SV11  74.6,42.5 180 top
SV12  74.6,37.5 180 top
SV13  74.6,32.5 180 top
SV14  74.6,27.5 180 top
SV15  55.7,11.8 0 top
SV16  46.2,11.8 0 top
USB1  40,5 90 top

### Tracks (layer width: path | path; a pad name or v marks a point on that pad's centre or on a via)
0V  (via drill 0.3)  (1 unrouted)
  Top 0.203: USB1.ID USB1.GND | IC2.74 v44.7,44.7
  Bottom 0.203: v54.7,26.5 54.65,26.45 J2.3 | B1.N 44.7,45.6 v44.7,44.7
  other vias: 30.5,31.4 36.8,32.1 48.7,47.5 21.8,31.4 17,58.2 14.8,58.2 15.9,58.2 24.6,54.8 25.7,54.8 26.8,54.8 9.1,20.9 9.1,19.7 9.1,18.5 70.4,21.9 70.4,20.8 70.4,19.7
  pour Top: 62.9,65.2 41.7,65.2 41.7,61.9 40.9,61.1 39.1,61.1 38.3,61.9 38.3,65.2 17.1,65.2 15,63.1 0.1,63.1 0.1,0.1 79.9,0.1 79.9,63.2 64.9,63.2
  pour Bottom (rank 2): 17.1,65.2 62.9,65.2 64.9,63.2 79.9,63.2 79.9,0.1 0.1,0.1 0.1,63.1 15,63.1
+3V3  (via drill 0.3)  (1 unrouted)
  Top 0.203: IC1.14 26.55,41.95 25.7,41.1 v25.7,39.9 25.7,38.5 25.25,38.05 23.6,38.05 | IC1.10 27.75,40.05 v27.6,39.9 | IC2.11 49.2,29.1 v48.9,28.8 | IC2.21 54.2,28.8 | 54.2,28.8 54.2,28.3 v54,28.1 53.8,27.9 53.8,25.2 54.1,24.9 54.7,24.9 | IC2.22 54.7,28.8 54.2,28.8 | IC2.28 59.4,33.1 59.67,32.83 C35.1 C34.1 59.67,26.88 59,26.2 59,25.4 | 58.12,45.91 IC2.50 57.2,44.1 57,43.9 57,39 56.7,38.7 56,38.7 55.7,38.4 v55.7,38 | 58.12,45.91 C36.1 | v61.6,35.9 60.35,35.9 R2.1 | v20.6,17.7 v21.8,17.7 | v21.8,17.7 v23,17.7 | v21.8,17.7 IC3.4 | 23.6,38.05 IC1.31 19.05,38.05 18.65,38.45 18.65,40.5 | IC1.26 18.7,40.55 18.65,40.5 | v23.6,37 23.6,38.05 | 54.7,24.9 57.4,24.9 57.9,25.4 59,25.4 | 54.7,24.9 v54.7,23 | C38.1 38.92,29.1 39.3,29.1 40.05,28.35 J1.3 40.35,28.35 41.2,29.2 41.2,30.3 42.28,31.38 IC2.100 43.4,32.1 43.5,32 45.1,32 v45.8,32.7 | 58.12,45.91 58.12,45.92 59,46.8 61.1,46.8 61.3,47 61.3,47.4 62.2,48.3 62.2,49.9 62.8,50.5 62.8,51.8 63.4,52.4 65.41,52.4 SV2.4 | R5.2 18.65,40.5 | IC2.75 44.2,46.9 44,47.1 42.02,47.1 C37.1 | C37.1 40.2,46.52 40.2,47 S2.4 | C37.1 40.83,45.83 40.1,45.1 v39.7,45.1 | 59,25.4 59.9,25.4 60.8,24.5 61.6,24.5 62,24.1 62,23.1 63.2,21.9 v69,21.9 | IC6.15 38.75,60.85 38.6,61 | 38.6,61 v37.9,61 | IC6.11 40.75,60.85 40.9,61 v41.6,61 | IC6.14 39.25,60.85 39.1,61 38.6,61 | IC6.18 36.58,58.15 C17.1 35.7,57.3 34.9,58.1 v34.7,58.1 33.9,58.9 33.9,62.1 33.5,62.5 30.3,62.5 30,62.8 30,63.7 29.5,64.2 27.2,64.2 26.82,63.83 IC4.14 IC4.15 26.18,63.83 25.8,64.2 21.73,64.2 C21.1 | IC6.9 43.05,58.65 v43.2,58.8 | v44.4,57.8 46,57.8 46.2,57.6 48.7,57.6 49.4,56.9 49.4,54.9 49,54.5 46.6,54.5 46.3,54.2 43,54.2 42.6,54.6 40.9,54.6 40.25,55.25 IC6.4
  Top 0.406: 11.2,44.8 18.45,44.8 R5.2 | 11.2,44.8 11.2,21.3 11.84,20.66 SV1.27 | 11.2,44.8 11.2,55.5 12.2,56.5 17.1,56.5 18.6,58 18.6,62.2 19.77,63.38 C21.1
  Top 0.61: IC3.2 IC3.4 22.8,18.3 24.8,20.3 C9.1
  Bottom 0.203: v25.7,39.9 v27.6,39.9 | 28.3,36.85 R12.2 R14.2 23.75,36.85 v23.6,37 | 28.3,36.85 R11.2 R15.2 R13.2 33.6,37.05 v33.6,37.9 37.1,37.9 40.5,41.3 40.5,44.3 v39.7,45.1 | SD1.4 28.3,36.85 | v54,28.1 52.8,28.1 52.1,28.8 v48.9,28.8 48.3,29.4 48.3,32.2 47.8,32.7 v45.8,32.7 | v54.7,23 54.65,23.05 J2.1 | v61.6,35.9 60.3,37.2 56,37.2 55.7,37.5 v55.7,38 | v34.7,58.1 36.7,58.1 37,58.4 37,60.7 37.3,61 v37.9,61 v41.6,61 42.8,61 43.2,60.6 v43.2,58.8 44.2,57.8 v44.4,57.8
  pour Bottom: 10.7,16.5 10.7,22 14.1,22 14.7,21.4 14.7,20.2 15.4,19.5 17.9,19.5 18.1,19.3 33.9,19.3 35.1,18.1 68.1,18.1 68.7,18.7 68.7,49.3 68.2,49.8 65.7,49.8 65.3,50.1 65.3,51.9 65.9,52.5 69.4,52.5 69.4,16.5 64.9,16.5 62.9,14.5 17,14.5 15,16.5
+5V  (via drill 0.3)
  Top 0.203: IC1.3 IC1.4 26.55,37.05 25.8,36.3 21.7,36.3 v21.5,36.5 | IC1.42 24.05,32.85 23.7,32.5 20.8,32.5 20.5,32.8 | 19.45,32.5 20.2,32.5 20.5,32.8 | v20.5,33.8 20.5,32.8
  Top 0.254: 19.45,32.5 R1.2
  Top 0.406: 20,26.7 19.2,27.5 18.3,27.5 17.8,28 17.8,31.2 18.3,31.7 18.65,31.7 R1.2
  Top 0.61: IC3.3 19.49,26.19 20,26.7 25.1,26.7 25.9,25.9 25.9,24.5 26.5,23.9 L1.1 27.7,22.5 28.1,22.1 29.6,22.1 31.4,20.3 C8.1 31.85,20.35 33.85,20.35 34.4,20.9 34.4,23 34.85,23.45 D1.C
  Bottom 0.203: v21.5,36.5 21,36.5 20.5,36 v20.5,33.8
BOOT0  (via drill 0.3)
  Top 0.203: IC2.94 40.1,35.1 39.4,35.8 39.4,37 v39.2,37.2 36.9,39.5 35.4,39.5 34.5,40.4 34.5,41.4 33.9,42 33.9,43.7 v33.5,44.1 | v37.3,34.9 37.3,34.55 R3.2
  Bottom 0.203: SV1.16 18,35.9 19.6,37.5 19.6,40.8 24.4,45.6 26,45.6 27.5,44.1 v33.5,44.1 | v37.3,34.9 37.8,34.9 39.2,36.3 v39.2,37.2
DCOUPL
  Top 0.203: IC6.5 40.75,55.45 41.1,55.1 C16.1
FOLDED_DIPOLE_ANTENNA
  Top 0.254: 39.6,61.5 39.75,61.35 | 39.75,61.35 39.75,61.25 | 39.75,61.25 IC6.13 | 40.4,61.5 40.25,61.35 | 40.25,61.35 40.25,61.25 | 40.25,61.25 IC6.12 | 40.25,61.25 40.5,61.5 40.5,61.6 40.4,61.6 40.25,61.45 40.25,61.35 | 39.75,61.25 39.5,61.5 39.5,61.6 39.6,61.6 39.75,61.45 39.75,61.35 | C121.2 41.05,62.7 | C131.1 38.95,62.7
  Top 0.31: 40.9,62 40.9,62.4 | 39.1,62.4 39.1,62
  Top 0.406: 41.05,62.3 41.05,62.15 40.9,62 40.5,61.6 40.4,61.5 | 38.95,62.3 38.95,62.15 39.1,62 39.5,61.6 39.6,61.5
  Top 0.61: 41.05,62.3 41.05,62.7 41.05,71.6 62.05,71.6 62.05,73.1 17.95,73.1 17.95,71.6 38.95,71.6 38.95,62.7 38.95,62.3
N$1
  Top 0.203: IC6.10 42.45,59.15 43,59.7 44.9,59.7 45,59.8 45,60.02 C15.2
  Top 0.254: C15.2 45.58,62.38 46,62.8 Q4.1
N$2
  Top 0.203: IC2.73 45.2,46.9 44.3,47.8 43.02,47.8 C3.1
N$3
  Top 0.203: IC6.8 42.75,58.15 43.1,57.8 43.3,57.8 44.2,58.7 C14.2 45.42,58.73 46.6,59.9 46.6,60.9 47,61.3 54.4,61.3 55.9,62.8 Q4.2
N$4
  Top 0.203: C4.1 59.2,44.83 59.2,43.8 59,43.6 IC2.49
N$5
  Top 0.203: IC1.8 30.35,39.05 30.5,39.2 31.2,39.2 32,38.4 32,33.8 34.7,31.1 34.7,26.9 35.2,26.4 38.3,26.4 39.2,25.5 USB1.D-
N$6
  Top 0.203: IC2.99 41.4,32.6 41.2,32.4 41.2,31.05 J1.2
N$7
  Top 0.203: R6.1 LED1.A
N$8
  Top 0.203: R7.1 LED2.A
N$9
  Top 0.203: R8.1 LED3.A
N$10
  Top 0.203: R9.1 LED4.A
N$11  (via drill 0.3)
  Top 0.203: IC1.7 30.65,38.55 v30.8,38.4 31,38.2 R10.2 | v32.5,38.9 32.5,34 35.2,31.3 35.2,27.4 35.7,26.9 38.5,26.9 40,25.4 USB1.D+
  Bottom 0.203: v30.8,38.4 31.4,38.4 31.9,38.9 v32.5,38.9
N$12
  Top 0.406: L1.2 30.3,24.5 32.9,24.5 34.1,25.7 37.9,25.7 38.4,25.2 USB1.VBUS
N$13
  Top 0.203: IC1.5 29.65,37.55 29.9,37.3 29.9,35.9 30.15,35.65 R10.1
N$14
  Top 0.203: C10.1 28.4,33.6 28,34 28,34.8 27.3,35.5 26.05,35.5 | IC1.46 26.05,35.5 | R1.1 19.1,33.9 19.8,34.6 20.6,34.6 21.8,35.8 25.75,35.8 26.05,35.5
N$15
  Top 0.203: 28.82,42.73 26.6,40.5 26.6,38.5 27.05,38.05 IC1.6
  Top 0.254: C11.1 28.82,42.73
N$16
  Top 0.203: IC1.44 25.05,31.05 25.9,30.2 28.6,30.2 29.1,29.7 Q3.1 30.93,29.68 C12.2
N$17
  Top 0.203: 23.3,29.7 25.1,27.9 27.2,27.9 27.62,27.48 C13.2 | 23.3,29.8 24.55,31.05 IC1.43
  Top 0.254: Q3.2 23.3,29.7 23.3,29.8
N$18
  Top 0.203: IC6.17 36.2,58.65 R16.2
N$19  (via drill 0.3)
  Top 0.203: v53.2,28.8 IC2.19
  Bottom 0.203: v53.2,28.8 55,28.8 55.5,28.3 55.5,25.2 55.05,24.75 J2.2
N$20
  Bottom 0.61: J3.2 32.4,5.1 35.4,2.1 50.8,2.1 51.3,2.6 POWER.2
NRST  (via drill 0.3)  (1 unrouted)
  Top 0.203: IC2.14 50.7,31.1 50.3,31.5 v50.3,32.5 | IC1.17 25.05,43.75 v25.2,43.9 24.1,45 R5.1 20.35,46.85 19.9,47.3 19.6,47.3 S1.3 19.3,49.9 19.7,50.3 20.5,50.3 21.2,51 21.2,54 | C7.1 20.57,54.62 21.2,54 | v22.7,54 21.2,54
  Bottom 0.203: SV2.30 65.39,19.4 62.6,19.4 57.6,24.4 57.6,28.2 55.8,30 53.8,30 52.7,31.1 52.1,31.1 51.8,31.4 51.8,32.1 51.4,32.5 v50.3,32.5 50.3,36.3 54.2,40.2 57.3,40.2 57.8,40.7 57.8,44.5 56.8,45.5 56.8,46.7 55.7,47.8 55.7,50.4 51.6,54.5 43.7,54.5 43.3,54.9 41.1,54.9 39.8,53.6 23.1,53.6 v22.7,54
PA0  (via drill 0.3)
  Top 0.203: IC2.23 55.2,31.6 55,31.8 v55,32.4 | S2.2 S2.1 31.25,52.25 30.6,52.9 v30.6,54.8 R4.2
  Bottom 0.203: SV2.25 62.8,23.2 62.4,23.6 62.4,24.5 61.6,25.3 61.6,26.4 60.6,27.4 60.6,32.4 60.1,32.9 56.9,32.9 56.4,32.4 v55,32.4 54,33.4 54,35.4 53.1,36.3 53.1,36.9 54.9,38.7 57.9,38.7 59.3,40.1 59.3,52.4 54.7,57 49.7,57 49.2,57.5 47.7,57.5 46.6,56.4 39.1,56.4 38.5,55.8 38.5,55.1 38,54.6 30.8,54.6 v30.6,54.8
PA1  (via drill 0.3)
  Top 0.203: IC2.24 55.7,33.4 v55.2,33.9 | SV2.24 68.3,27.37 68.3,31.7 69.7,33.1 69.7,37 70.2,37.5 SV12.3
  Bottom 0.203: SV2.24 65.41,27 63.1,27 62.1,28 62.1,33.3 60.8,34.6 55.9,34.6 v55.2,33.9
PA2  (via drill 0.3)
  Top 0.203: IC2.25 v56.2,33.9 | SV2.23 65.37,24.5 68.2,24.5 68.8,25.1 68.8,31.5 69.8,32.5 SV13.3
  Bottom 0.203: SV2.23 62.86,25.74 62.6,26 62.6,26.8 61.6,27.8 61.6,33 60.7,33.9 v56.2,33.9
PA3  (via drill 0.3)
  Top 0.203: IC2.26 58.12,31.58 58.3,31.4 58.6,31.4 58.8,31.2 v58.8,27.2 | v60,26.1 60.2,26.3 60.2,26.7 60.5,27 65.4,27 SV2.22 | C18.1 21.82,56.6 27.5,56.6 | IC4.8 27.48,56.62 27.5,56.6 | 27.5,56.6 28.1,56.6 28.4,56.3 v28.4,54.8
  Bottom 0.203: v60,26.1 v58.8,27.2 58.8,28.4 56.2,31 54.2,31 53,32.2 53,33.4 51.3,35.1 51.3,35.9 54.6,39.2 57.7,39.2 58.8,40.3 58.8,52.1 54.4,56.5 49.5,56.5 49,57 47.9,57 46.8,55.9 39.5,55.9 39,55.4 39,54.9 38.2,54.1 28.7,54.1 28.4,54.4 v28.4,54.8
PA4
  Top 0.203: IC2.29 61,33.6 61.2,33.4 61.2,31.1 62.3,30 62.3,28.8 62.8,28.3 64.11,28.3 SV2.21
PA5
  Top 0.203: IC2.30 61.4,34.1 61.7,33.8 61.7,31.3 62.8,30.2 62.8,29.8 63.1,29.5 65.4,29.5 66.67,30.77 SV2.20 69.2,33.35 69.2,41.6 70.1,42.5 SV11.3
PA6
  Top 0.203: IC2.31 61.8,34.6 62.2,34.2 62.2,31.5 62.9,30.8 64.11,30.8 SV2.19
PA7
  Top 0.203: IC2.32 62,35.1 62.7,34.4 62.7,32.6 63.2,32.1 65.4,32.1 SV2.18 68.7,35.39 68.7,46.7 69.5,47.5 SV10.3
PA8  (via drill 0.3)
  Top 0.203: IC2.67 48.2,44.9 v48,44.7
  Bottom 0.203: SV1.13 14.6,39.7 17.7,39.7 18.1,40.1 18.1,41.4 23.8,47.1 26.6,47.1 27.9,45.8 37.7,45.8 38.6,46.7 39.4,46.7 40.3,45.8 41.8,45.8 43.7,43.9 47.2,43.9 v48,44.7
PA9
  Top 0.203: IC2.68 47.7,48.4 48,48.7 52.1,48.7 53.6,50.2 R6.2
PA10
  Top 0.203: IC2.69 47.2,48.7 47.7,49.2 51.8,49.2 52.7,50.1 52.7,51.55 R7.2
PA11
  Top 0.203: IC2.70 46.7,47.7 45.1,49.3 45.1,51.1 44.9,51.3 44.6,51.3 44.3,51.6 44.3,52.45 R8.2
PA12
  Top 0.203: IC2.71 46.2,47.3 44.3,49.2 44.3,50.15 R9.2
PA13  (via drill 0.3)
  Top 0.203: IC1.21 23.05,40.85 v23.3,40.6 | IC2.72 45.7,47.1 44.5,48.3 43.6,48.3 43.4,48.5 43.4,49.1 43.2,49.3 38.3,49.3 37.7,48.7 37.7,47 v38.9,45.8
  Bottom 0.203: v23.3,40.6 24.6,40.6 25.1,41.1 29.7,41.1 30.2,41.6 36.4,41.6 36.8,42 36.8,43.7 v38.9,45.8
PA14  (via drill 0.3)
  Top 0.203: IC1.24 21.55,39.45 v21.4,39.3 | IC2.76 v38.3,44.1
  Bottom 0.203: v21.4,39.3 22,38.7 29.4,38.7 30.8,40.1 33.1,40.1 33.6,39.6 36.4,39.6 38.3,41.5 v38.3,44.1
PA15  (via drill 0.3)
  Top 0.203: IC1.23 22.05,39.75 v22.4,39.4 | IC2.77 38.8,43.6 38.4,43.2 v37.5,43.2
  Bottom 0.203: v22.4,39.4 22.6,39.2 29.2,39.2 30.6,40.6 33.3,40.6 33.8,40.1 36.1,40.1 37.5,41.5 v37.5,43.2
PB0  (via drill 0.3)
  Top 0.203: IC2.35 55.1,36.6 v54.8,36.9 54.5,37.2 54.5,39.5 53.9,40.1 49.2,40.1 v47.1,42.2 | IC4.12 31.65,61.48 C20.1 32.8,60.62 32.8,58.7 32.5,58.4 30.9,58.4 30.6,58.1 30.6,55.8 29.7,54.9 29.7,45.3 30,45 32.3,45 32.8,44.5 32.8,43.7 33.4,43.1 33.4,41.8 34,41.2 34,40.2 35.2,39 36.7,39 38,37.7 v38,36.2
  Bottom 0.203: v54.8,36.9 55.1,36.6 59.7,36.6 62.9,33.4 64.09,33.4 SV2.17 | v47.1,42.2 47.1,40.9 46.7,40.5 42.3,40.5 39.8,38 39,38 38,37 v38,36.2
PB1  (via drill 0.3)
  Top 0.203: SV2.16 66.67,35.84 65.43,34.6 63.2,34.6 62.5,35.3 62.5,36.4 62.1,36.8 59.5,36.8 59.2,37.1 IC2.36 55.6,37.1 55,37.7 55,40.2 54.1,41.1 49.4,41.1 47.3,43.2 v47.1,43.2 | IC4.10 30.9,60.17 C19.1 31.43,58.9 30.7,58.9 30.1,58.3 30.1,56 29.2,55.1 29.2,44.9 29.6,44.5 32,44.5 32.3,44.2 32.3,43.5 32.9,42.9 32.9,41.6 33.5,41 33.5,40 35,38.5 36.5,38.5 37.1,37.9 v37.1,36.7
  Bottom 0.203: v47.1,43.2 46.9,43.4 44,43.4 43.6,43 43.6,41.4 43.2,41 42.1,41 39.6,38.5 38.6,38.5 37.1,37 v37.1,36.7
PB2
  Top 0.203: IC2.37 60.25,37.6 R2.2 60.35,37.6 62.4,37.6 64.1,35.9 SV2.15
PB3  (via drill 0.3)
  Top 0.203: IC1.22 22.55,40.35 23,39.9 v24.6,39.9 | IC2.89 41.2,37.6 39.7,39.1 38.8,39.1 37.4,40.5 36.1,40.5 v35.7,40.9
  Bottom 0.203: v24.6,39.9 25.3,40.6 29.9,40.6 30.4,41.1 35.5,41.1 v35.7,40.9
PB4  (via drill 0.3)
  Top 0.203: IC1.20 23.55,41.75 v23.8,41.5 | IC2.90 41,37.1 39.5,38.6 38.6,38.6 37.2,40 35.6,40 35,40.6 35,41.9 v34.6,42.3
  Bottom 0.203: v23.8,41.5 23.9,41.6 29.5,41.6 30.2,42.3 v34.6,42.3
PB5  (via drill 0.3)
  Top 0.203: v45.8,36.4 45.6,36.6 IC2.91
  Bottom 0.203: SV1.21 13.33,28.33 14.6,29.6 17.4,29.6 17.8,29.2 17.8,28.7 19,27.5 41.1,27.5 41.5,27.9 41.5,33.7 42.9,35.1 42.9,35.9 43.6,36.6 45.6,36.6 v45.8,36.4
PB6  (via drill 0.3)
  Top 0.203: v44.9,35.9 44.7,36.1 IC2.92
  Bottom 0.203: SV1.22 15.89,28.3 17.4,28.3 18.7,27 41.6,27 42,27.4 42,33.5 42.9,34.4 43.2,34.4 43.4,34.6 43.4,35.7 43.8,36.1 44.7,36.1 v44.9,35.9
PB7  (via drill 0.3)
  Top 0.203: v44.1,35.3 43.8,35.6 IC2.93
  Bottom 0.203: SV1.23 14.6,27 17,27 17.5,26.5 42.1,26.5 42.5,26.9 42.5,33.3 43.1,33.9 43.8,33.9 44.1,34.2 v44.1,35.3
PB8  (via drill 0.3)
  Top 0.203: IC2.95 43.9,34.6 44.3,34.2 44.3,33.6 v44.9,33
  Bottom 0.203: SV1.24 15.91,25.7 20.6,25.7 20.9,26 42.5,26 43,26.5 43,33.1 43.3,33.4 44.5,33.4 v44.9,33
PB9  (via drill 0.3)
  Top 0.203: IC2.96 43.5,34.1 43.8,33.8 43.8,32.9 v44,32.7
  Bottom 0.203: SV1.25 13.33,23.23 14.6,24.5 20.2,24.5 21.2,25.5 42.9,25.5 43.5,26.1 43.5,32.2 v44,32.7
PB10  (via drill 0.3)
  Top 0.203: IC2.47 59.4,42.6 61.8,45 61.8,45.8 62.3,46.3 62.3,46.9 64,48.6 SV2.5 | v37.8,55.4 38.5,55.4 38.75,55.65 IC6.1
  Bottom 0.203: SV2.5 60.4,48.6 59.8,49.2 59.8,52.7 55,57.5 49.9,57.5 49.4,58 47.5,58 46.4,56.9 38.7,56.9 37.8,56 v37.8,55.4
PB11
  Top 0.203: IC2.48 59.2,43.1 61.3,45.2 61.3,46 61.8,46.5 61.8,47.2 62.7,48.1 62.7,49.71 SV2.3 65.37,49.9 68.5,49.9 69.4,50.8 69.4,51.7 70.2,52.5 SV9.3
PB12  (via drill 0.3)
  Top 0.203: v56.4,44.7 56.2,44.9 IC2.51
  Bottom 0.203: v56.4,44.7 56.2,44.9 56.2,46.6 55.2,47.6 55.2,50.2 51.4,54 43.5,54 43.1,54.4 41.3,54.4 40,53.1 22.5,53.1 21.4,54.2 18.1,54.2 17.3,55 14.6,55 13.33,53.73 SV1.1 11.58,53.68 9.9,52 9.9,48 9.4,47.5 SV4.3
PB13  (via drill 0.3)
  Top 0.203: v55.9,43.9 55.7,44.1 IC2.52 | SV1.2 15.87,55.23 15.6,55.5 v12.5,55.5
  Bottom 0.203: SV1.2 15.89,53.7 21.1,53.7 22.2,52.6 40.2,52.6 41.5,53.9 42.9,53.9 43.3,53.5 51.2,53.5 54.7,50 54.7,47.4 55.7,46.4 55.7,44.1 v55.9,43.9 | v12.5,55.5 8.5,55.5 7.94,54.94 SV3.3
PB14  (via drill 0.3)
  Top 0.203: v55.4,43.1 55.2,43.3 IC2.53 | v42.5,53.2 41.9,53.8 38.2,53.8 38,54 38,54.6 38.3,54.9 38.7,54.9 39.25,55.45 IC6.2
  Bottom 0.203: SV1.3 14.6,52.4 21.6,52.4 21.9,52.1 40.4,52.1 41.5,53.2 v42.5,53.2 42.7,53 51,53 54.2,49.8 54.2,47.2 55.2,46.2 55.2,43.3 v55.4,43.1
PB15  (via drill 0.3)
  Top 0.203: v54.7,42.4 IC2.54 | v41.8,52.5 41,53.3 37.6,53.3 37.1,53.8 37.1,57 37.25,57.15 IC6.20
  Bottom 0.203: SV1.4 15.93,51.2 21.6,51.2 22,51.6 40.9,51.6 v41.8,52.5 50.8,52.5 53.7,49.6 53.7,47 54.7,46 v54.7,42.4
PC0  (via drill 0.3)
  Top 0.203: IC2.15 51.2,31.6 v51,31.8 | v17.9,20.9 17.9,19.7 v18.2,19.4
  Bottom 0.203: v51,31.8 51,31 51.4,30.6 52.5,30.6 53.6,29.5 55.6,29.5 57.1,28 57.1,23.8 61.8,19.1 61.8,18.2 | SV8.3 9.8,27.6 10.3,27.1 10.3,22.5 10.9,21.9 16.9,21.9 v17.9,20.9 | 61.8,18.2 64.05,18.2 SV2.29 | 61.8,18.2 35.1,18.2 33.9,19.4 v18.2,19.4
PC1  (via drill 0.3)
  Top 0.203: IC2.16 51.7,32.7 v51.2,33.2 | v61.2,21.9 61.2,23.7 v61.3,23.8 | SV2.28 65.4,19.39 65.4,17 64.2,15.8 60.7,15.8 60.2,15.3 60.2,9.6 59.3,8.7 49.4,8.7 48.74,9.36 SV16.3
  Bottom 0.203: SV2.28 65.43,21.9 63.3,21.9 v61.3,23.8 | v61.2,21.9 58.1,25 58.1,28.4 56,30.5 54,30.5 52.9,31.6 52.6,31.6 52.3,31.9 52.3,32.4 51.5,33.2 v51.2,33.2
PC2  (via drill 0.3)
  Top 0.203: v51.1,34.2 51.2,34.2 52.2,33.2 IC2.17 | IC6.7 42.55,57.65 42.9,57.3 43.8,57.3 44,57.1 48.2,57.1 48.6,56.7 v48.6,56.3
  Bottom 0.203: v51.1,34.2 50.8,34.5 50.8,36.1 54.4,39.7 57.5,39.7 58.3,40.5 58.3,51.8 54.1,56 48.9,56 v48.6,56.3
PC4  (via drill 0.3)
  Top 0.203: v52.4,35.9 52.7,35.6 IC2.33 | SV2.27 64.07,20.6 62.9,20.6 62.4,20.1 62.4,17.4 61.8,16.8 59.4,16.8 58.24,15.64 SV15.3
  Bottom 0.203: v52.4,35.9 52.8,35.9 53.5,35.2 53.5,32.4 54.2,31.7 56.4,31.7 57.1,32.4 59.8,32.4 60.1,32.1 60.1,27.1 60.8,26.4 60.8,25.9 60.1,25.2 60.1,24 61.9,22.2 61.9,21.2 62.5,20.6 64.07,20.6 SV2.27
PC5  (via drill 0.3)
  Top 0.203: v53.8,36.6 54.3,36.1 IC2.34 | SV2.26 68.2,23.2 69.3,24.3 69.3,26.8 70,27.5 SV14.3
  Bottom 0.203: SV2.26 65.37,24.5 63.2,24.5 62.1,25.6 62.1,26.6 61.1,27.6 61.1,32.7 60.4,33.4 56.7,33.4 56.4,33.1 55,33.1 54.5,33.6 54.5,35.6 53.8,36.3 v53.8,36.6
PC6  (via drill 0.3)
  Top 0.203: v50.4,42.3 50.2,42.5 IC2.63
  Bottom 0.203: SV1.11 14.6,42.25 17.55,42.25 23.4,48.1 42.5,48.1 43.4,49 49.4,49 50.2,48.2 50.2,42.5 v50.4,42.3
PC7  (via drill 0.3)
  Top 0.203: v49.5,42 49.7,42.2 IC2.64
  Bottom 0.203: SV1.12 16.98,40.98 23.6,47.6 42.7,47.6 43.6,48.5 49.2,48.5 49.7,48 49.7,42.2 v49.5,42
PC8  (via drill 0.3)
  Top 0.203: IC2.65 49.2,43.1 v49,42.9
  Bottom 0.203: R11.1 30.25,34.2 31.4,34.2 31.6,34 SD1.7 31.6,30.6 32.2,30 38.5,30 39,30.5 39,34.7 40.4,36.1 40.4,37.2 42.7,39.5 47.1,39.5 48.3,40.7 48.3,42.3 48.9,42.9 v49,42.9
PC9  (via drill 0.3)
  Top 0.203: IC2.66 48.7,44 v48.5,43.8
  Bottom 0.203: R15.1 32.7,33.95 SD1.8 32.7,31 33.2,30.5 38,30.5 38.5,31 38.5,34.9 39.9,36.3 39.9,37.4 42.5,40 46.9,40 47.8,40.9 47.8,43.1 v48.5,43.8
PC10  (via drill 0.3)
  Top 0.203: IC1.39 22.55,34.85 v22.3,35.1 | IC2.78 39.3,43.1 v39,42.8
  Bottom 0.203: v22.3,35.1 22.3,38 22.5,38.2 29.6,38.2 31,39.6 32.9,39.6 33.4,39.1 36.7,39.1 39,41.4 v39,42.8
PC11  (via drill 0.3)
  Top 0.203: IC1.40 23.05,34.85 v23.3,35.1 | IC2.79 40.1,42.6 v39.8,42.3
  Bottom 0.203: v23.3,35.1 23.3,35.7 22.8,36.2 22.8,37.5 23,37.7 32.3,37.7 33.2,38.6 37,38.6 39.8,41.4 v39.8,42.3
PC12  (via drill 0.3)
  Top 0.203: IC2.80 43.3,42.1 43.6,41.8 43.6,40.9 44.1,40.4 44.1,40 45.1,39 45.3,39 v46,38.3
  Bottom 0.203: SD1.5 29.4,30.2 30.1,29.5 39,29.5 39.5,30 39.5,34.5 40.9,35.9 40.9,37 42.9,39 45.3,39 v46,38.3
PC13  (via drill 0.3)
  Top 0.203: v47.5,31.9 47.2,31.6 IC2.7
  Bottom 0.203: v47.5,31.9 47.2,31.6 47.2,28.4 46.7,27.9 45.7,27.9 45.5,27.7 45.5,27.3 45.2,27 45.2,25.5 44.2,24.5 21.8,24.5 21.3,24 21.3,21.3 20.2,20.2 17.5,20.2 17.04,20.66 SV1.28
PC14
  Top 0.203: IC2.8 47.7,28.27 C6.1 49.6,27.1 49.9,26.8 50.65,26.8 Q2.4
PC15
  Top 0.203: C5.1 48.88,23.73 49.5,23.1 Q2.1 51.15,23.45 52.3,24.6 52.3,27.3 52,27.6 50,27.6 49.5,28.1 48.6,28.1 48.2,28.5 IC2.9
PD0  (via drill 0.3)
  Top 0.203: IC2.81 39.1,41.6 38.2,42.5 37.2,42.5 36.8,42.9 36.8,44.1 37.2,44.5 v37.2,45.1
  Bottom 0.203: SV1.14 15.87,38.4 18,38.4 18.6,39 18.6,41.2 24,46.6 26.4,46.6 27.7,45.3 37,45.3 v37.2,45.1
PD1  (via drill 0.3)
  Top 0.203: IC2.82 38.9,41.1 38,42 37,42 36.3,42.7 v36.3,44.6
  Bottom 0.203: SV1.15 13.33,35.93 14.6,37.2 18.5,37.2 19.1,37.8 19.1,41 24.2,46.1 26.2,46.1 27.5,44.8 36.1,44.8 v36.3,44.6
PD2  (via drill 0.3)
  Top 0.203: IC2.83 43.2,40.6 43.6,40.2 43.6,39.7 v45,38.3
  Bottom 0.203: SD1.3 27.2,29.8 28,29 39.5,29 40,29.5 40,34.3 41.4,35.7 41.4,36.8 42.9,38.3 v45,38.3
PD3  (via drill 0.3)
  Top 0.203: IC2.84 39.2,40.1 37.8,41.5 36.8,41.5 35.8,42.5 35.8,43.8 v35.5,44.1
  Bottom 0.203: v35.5,44.1 35.2,43.8 34.3,43.8 33.8,43.3 27.6,43.3 25.8,45.1 24.6,45.1 20.1,40.6 20.1,37.2 17.5,34.6 14.6,34.6 13.36,33.36 SV1.17 12.14,33.36 11.6,33.9 11.6,41.8 10.9,42.5 SV5.3
PD4  (via drill 0.3)
  Top 0.203: IC2.85 39,39.6 37.6,41 36.6,41 35.3,42.3 35.3,42.9 v35.1,43.1
  Bottom 0.203: SV1.18 15.91,33.4 18.1,33.4 19,34.3 19,35.3 20.6,36.9 20.6,40.4 24.8,44.6 25.6,44.6 27.4,42.8 34,42.8 34.3,43.1 v35.1,43.1
PD5  (via drill 0.3)
  Top 0.203: v47.6,37.4 47.4,37.6 44.7,37.6 43.2,39.1 IC2.86
  Bottom 0.203: SV1.19 14.6,32.1 17.4,32.1 18.8,30.7 18.8,29.1 19.4,28.5 40,28.5 40.5,29 40.5,34.1 41.9,35.5 41.9,36.5 43,37.6 47.4,37.6 v47.6,37.4
PD7  (via drill 0.3)
  Top 0.203: v46.7,36.9 46.5,37.1 44.3,37.1 43.3,38.1 IC2.88 | SV1.20 14.59,32.1 v12.1,32.1
  Bottom 0.203: SV1.20 15.89,30.8 17.4,30.8 18.3,29.9 18.3,28.9 19.2,28 40.5,28 41,28.5 41,33.9 42.4,35.3 42.4,36.2 43.3,37.1 46.5,37.1 v46.7,36.9 | v12.1,32.1 11.1,33.1 11.1,36.9 10.5,37.5 SV6.3
PD8  (via drill 0.3)
  Top 0.203: v54,43.1 54.2,43.3 IC2.55
  Bottom 0.203: SV1.5 13.33,48.63 14.6,49.9 21,49.9 22.2,51.1 41.4,51.1 42.3,52 50.6,52 53.2,49.4 53.2,46.8 54.2,45.8 54.2,43.3 v54,43.1
PD9  (via drill 0.3)
  Top 0.203: v53.5,43.9 53.7,44.1 IC2.56
  Bottom 0.203: SV1.6 20.4,48.6 22.4,50.6 41.6,50.6 42.5,51.5 50.4,51.5 52.7,49.2 52.7,46.6 53.7,45.6 53.7,44.1 v53.5,43.9
PD10  (via drill 0.3)
  Top 0.203: v53,44.7 53.2,44.9 IC2.57
  Bottom 0.203: SV1.7 13.36,46.06 14.6,47.3 19.8,47.3 22.6,50.1 41.8,50.1 42.7,51 50.2,51 52.2,49 52.2,46.4 53.2,45.4 53.2,44.9 v53,44.7
PD11  (via drill 0.3)
  Top 0.203: IC6.6 42.35,57.15 42.7,56.8 43.6,56.8 43.8,56.6 47.5,56.6 47.8,56.3 v47.8,55.7 | IC2.58 52.7,47 52.9,47.2 56.7,47.2 v57,47.5
  Bottom 0.203: v57,47.5 57.8,48.3 57.8,51.5 53.8,55.5 48,55.5 v47.8,55.7
PD12  (via drill 0.3)
  Top 0.203: IC2.59 52.2,47.2 52.7,47.7 56.1,47.7 56.9,48.5 v57,48.5 | IC6.3 39.75,54.65 v39.7,54.6
  Bottom 0.203: v57,48.5 57.3,48.8 57.3,51.2 53.5,55 43.9,55 43.5,55.4 40.1,55.4 39.7,55 v39.7,54.6
PD13  (via drill 0.3)
  Top 0.203: v51.9,44.7 51.7,44.9 IC2.60
  Bottom 0.203: SV1.8 15.91,46.1 19.3,46.1 22.8,49.6 42,49.6 42.9,50.5 50,50.5 51.7,48.8 51.7,44.9 v51.9,44.7
PD14  (via drill 0.3)
  Top 0.203: v51.4,43.9 51.2,44.1 IC2.61
  Bottom 0.203: SV1.9 14.6,44.8 18.7,44.8 23,49.1 42.1,49.1 43,50 49.8,50 51.2,48.6 51.2,44.1 v51.4,43.9
PD15  (via drill 0.3)
  Top 0.203: v50.9,43.1 50.7,43.3 IC2.62
  Bottom 0.203: SV1.10 15.89,43.5 18.1,43.5 23.2,48.6 42.3,48.6 43.2,49.5 49.6,49.5 50.7,48.4 50.7,43.3 v50.9,43.1
PE2  (via drill 0.3)
  Top 0.203: IC2.1 44.2,28.4 43.9,28.1 43.9,26.2 43.5,25.8 40.3,25.8 38.7,27.4 36.8,27.4 36.3,27.9 36.3,30.7 v35.9,31.2
  Bottom 0.203: R13.1 SD1.9 33.8,31.3 34.1,31 35.7,31 v35.9,31.2
PE3  (via drill 0.3)
  Top 0.203: v44.7,27.6 IC2.2 | SV1.26 14.57,24.5 v12.1,24.5
  Bottom 0.203: SV1.26 17.4,23.2 17.9,22.7 17.9,21.9 18.6,21.2 20.4,21.2 20.8,21.6 20.8,24.3 21.5,25 44,25 44.7,25.7 v44.7,27.6 | v12.1,24.5 11.4,25.2 11.4,31.6 10.5,32.5 SV7.3
PE7  (via drill 0.3)
  Top 0.203: v56.7,37.9 56.9,38.1 IC2.38
  Bottom 0.203: v56.7,37.9 56.9,38.1 62,38.1 62.9,37.2 65.43,37.2 SV2.14
PE8
  Top 0.203: IC2.39 62.7,38.6 62.9,38.4 64.09,38.4 SV2.13
PE9
  Top 0.203: IC2.40 61.4,39.1 62,39.7 65.4,39.7 SV2.12
PE10
  Top 0.203: IC2.41 61.2,39.6 62.6,41 64.11,41 SV2.11
PE11
  Top 0.203: IC2.42 61,40.1 61.7,40.8 61.7,42 61.95,42.25 65.4,42.25 SV2.10
PE12
  Top 0.203: IC2.43 60.8,40.6 61.2,41 61.2,42.3 62.5,43.6 64.05,43.6 SV2.9
PE13  (via drill 0.3)
  Top 0.203: v60.5,41.3 60.3,41.1 IC2.44
  Bottom 0.203: v60.5,41.3 61.3,42.1 61.3,42.8 63.3,44.8 65.41,44.8 SV2.8
PE14
  Top 0.203: SV2.7 64.09,46.1 63.6,46.1 62.8,45.3 62.8,44.6 59.8,41.6 IC2.45
PE15
  Top 0.203: SV2.6 65.42,47.35 63.45,47.35 62.8,46.7 62.8,46.1 62.3,45.6 62.3,44.8 59.6,42.1 IC2.46
PH0
  Top 0.203: C1.1 47.1,19.5 47.4,19.2 Q1.2 51,19.2 52.2,20.4 52.2,23.8 52.8,24.4 52.8,27.5 52.2,28.1 50.2,28.1 49.7,28.6 IC2.12
PH1
  Top 0.203: IC2.13 50.2,28.8 50.4,28.6 52.4,28.6 53.3,27.7 53.3,24.2 52.7,23.6 52.7,19.9 53.4,19.2 Q1.1 58.75,21.35 58.2,21.9 58.2,23.48 C2.1
SDIO_D2
  Bottom 0.203: R14.1 SD1.1
SDIO_D3
  Bottom 0.203: SD1.2 26.1,34.05 R12.1
SPWR  (via drill 0.3)
  Top 0.61: D1.A v36.4,14.6 | SV3.2 SV8.2 | SV9.2 SV14.2
  Bottom 0.61: SV3.2 SV4.2 SV5.2 SV6.2 SV7.2 SV8.2 5.4,24.8 5.8,24.4 6.6,24.4 7.4,23.6 7.4,9.8 9.8,7.4 17.5,7.4 18.6,8.5 18.6,13.8 19.5,14.6 v36.4,14.6 45.5,14.6 46.2,13.9 | SV9.2 SV10.2 SV11.2 SV12.2 SV13.2 SV14.2 74.6,24.5 74.2,24.1 73.1,24.1 72.5,23.5 72.5,10.3 69.5,7.3 65,7.3 63.5,8.7 56.3,8.7 55.7,9.3 SV15.2 55.7,14.1 55.2,14.6 46.9,14.6 46.2,13.9 | 46.2,13.9 SV16.2 46.2,8.8 46.6,8.4 48.4,8.4 48.76,8.04 POWER.1
VBAT  (via drill 0.3)
  Top 0.203: IC2.6 46.7,29.3 46.2,28.8 v45.4,28.8
  Bottom 0.203: B1.P 45.3,29.6 v45.4,28.8

### Text on the board
tPlace: NODINO-RC7 | www.aisenke.com | PB12 | GND | PB13 | GND | PB14 | PB11 | PB15 | 3V3 | PD8 | PB10 | PD9 | PE15 | PD10 | PD13 | PE13 | PE14 | PD14 | PE12 | PD15 | PE11 | PC6 | PC7 | PE10 | PE9 | PA8 | PE8 | PD0 | PE7 | PB2 | PD1 | PB1 | BOOT0 | PD3 | PB0 | PD4 | PA7 | PD5 | PD7 | PA6 | PA5 | PB5 | PA4 | PB6 | PA3 | PB7 | PA2 | PB8 | PA1 | PB9 | PA0 | PE3 | PC5 | 3V3 | PC4 | PC1 | PC13 | GND | GND | PC0 | NRST | NODINO | R | ROBOTICS | (-) | (+) | ON | OFF
bPlace: R | NODINO ROBOTICS | Aisenke Electronics Tech.Co.,Ltd. | CR1220 | www.aisenke.com